# EAGLE design ttgo (EAGLE 9.6.2)

## Sheet 1 of 3
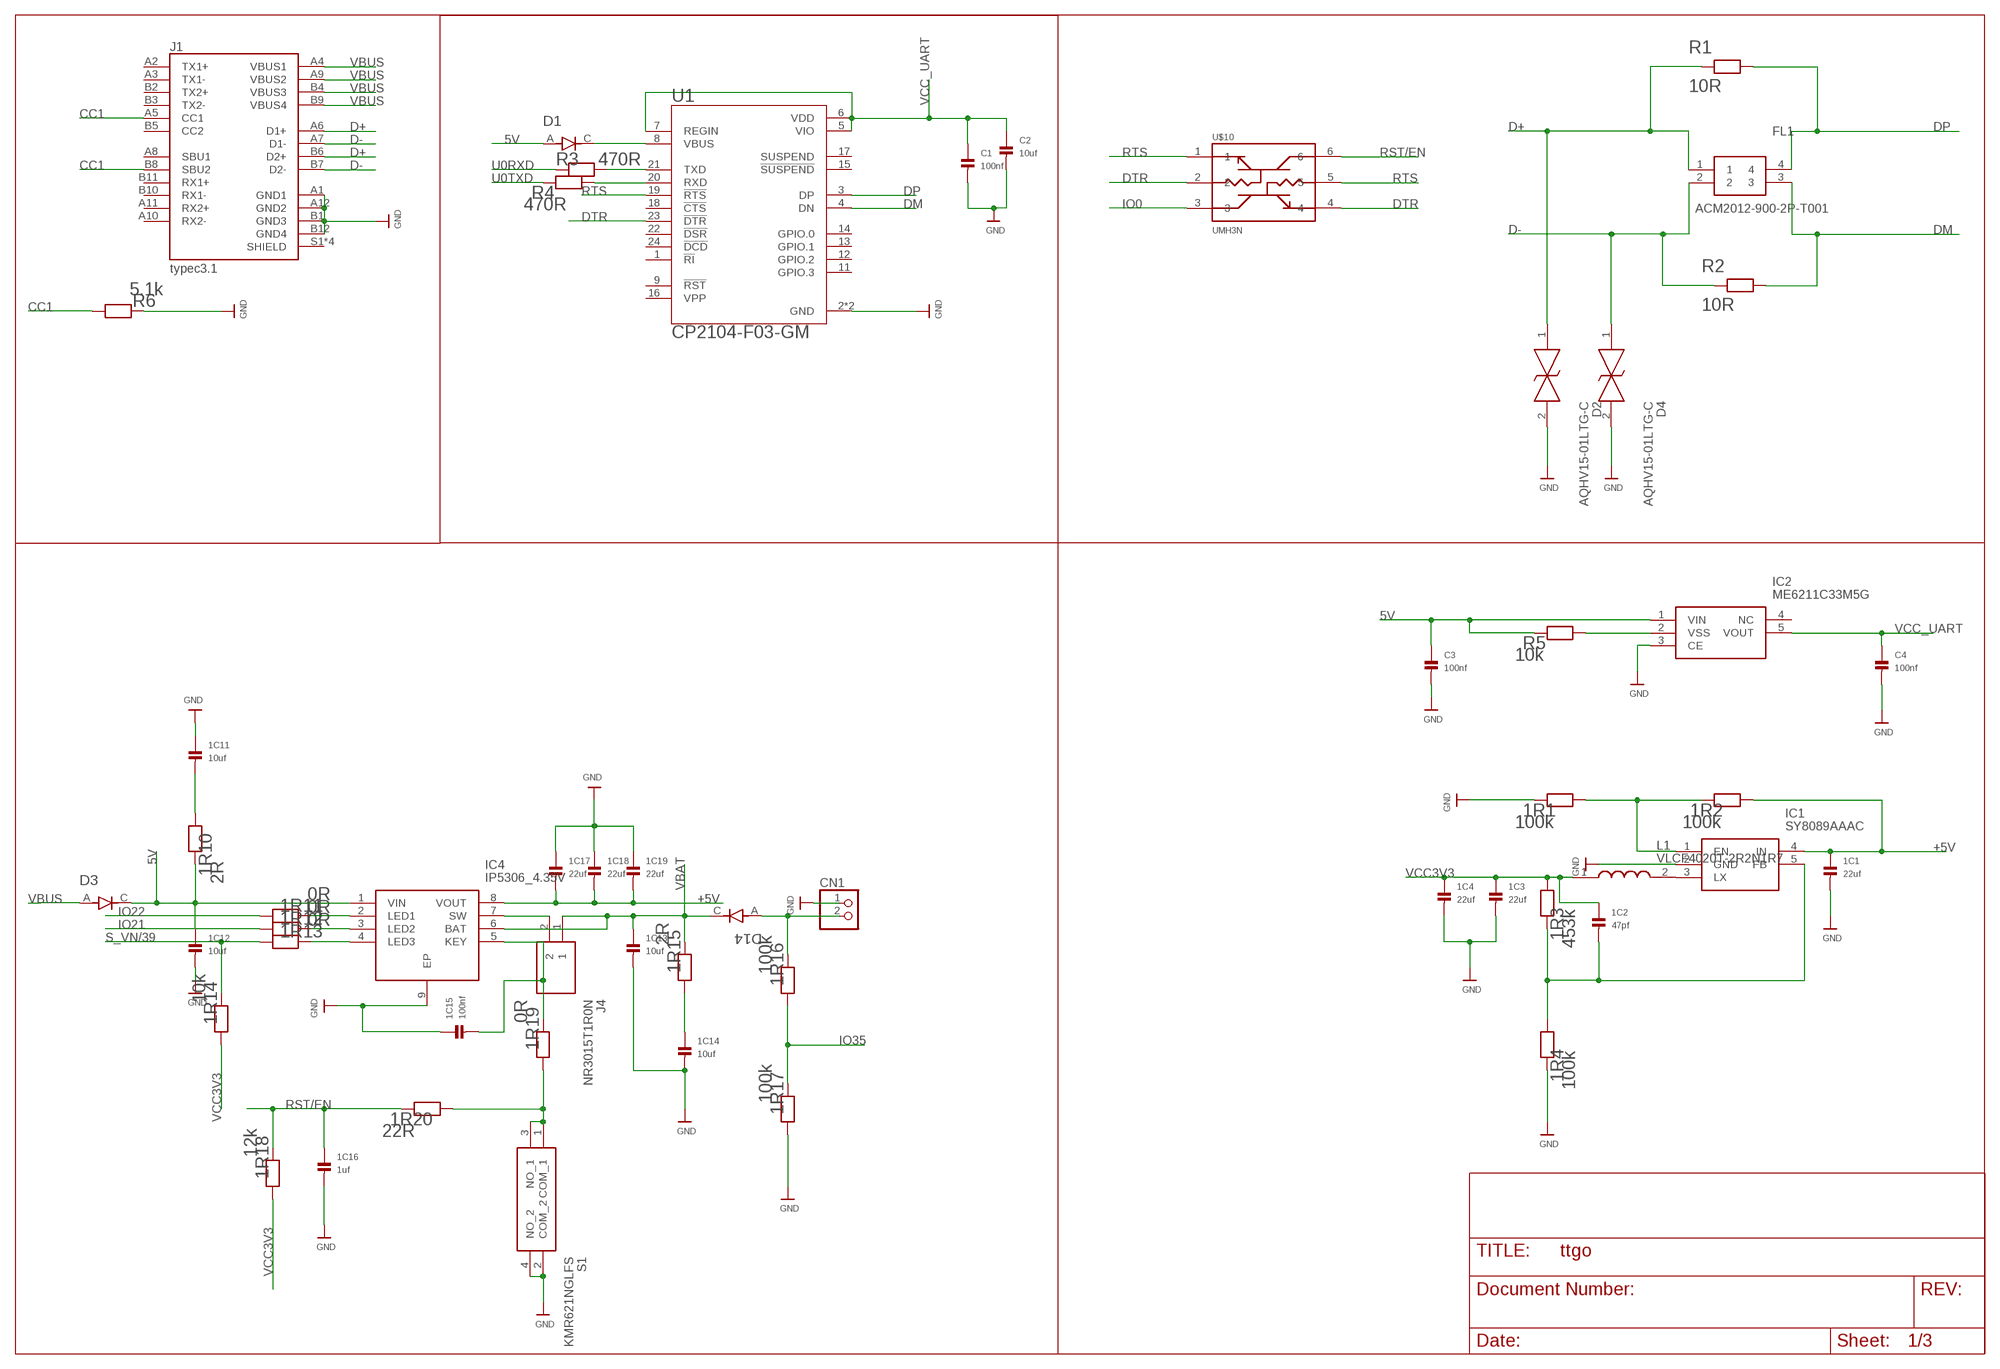
[diagram p0: schematic, sheet 1]

### Parts
1C1  22uf  CAP_CERAMIC_0402  [_0402]
1C2  47pf  CAP_CERAMIC_0402  [_0402]
1C3  22uf  CAP_CERAMIC_0402  [_0402]
1C4  22uf  CAP_CERAMIC_0402  [_0402]
1C11  10uf  CAP_CERAMIC_0402  [_0402]
1C12  10uf  CAP_CERAMIC_0402  [_0402]
1C13  10uf  CAP_CERAMIC_0402  [_0402]
1C14  10uf  CAP_CERAMIC_0402  [_0402]
1C15  100nf  CAP_CERAMIC_0402  [_0402]
1C16  1uf  CAP_CERAMIC_0402  [_0402]
1C17  22uf  CAP_CERAMIC_0402  [_0402]
1C18  22uf  CAP_CERAMIC_0402  [_0402]
1C19  22uf  CAP_CERAMIC_0402  [_0402]
1R1  100k  RESISTOR0402  [0402]
1R2  100k  RESISTOR0402  [0402]
1R3  453k  RESISTOR0402  [0402]
1R4  100k  RESISTOR0402  [0402]
1R10  2R  RESISTOR0402  [0402]
1R11  0R  RESISTOR0402  [0402]
1R12  0R  RESISTOR0402  [0402]
1R13  0R  RESISTOR0402  [0402]
1R14  10k  RESISTOR0402  [0402]
1R15  2R  RESISTOR0402  [0402]
1R16  100k  RESISTOR0402  [0402]
1R17  100k  RESISTOR0402  [0402]
1R18  12k  RESISTOR0402  [0402]
1R19  0R  RESISTOR0402  [0402]
1R20  22R  RESISTOR0402  [0402]
C1  100nf  CAP_CERAMIC_0402  [_0402]
C2  10uf  CAP_CERAMIC_0402  [_0402]
C3  100nf  CAP_CERAMIC_0402  [_0402]
C4  100nf  CAP_CERAMIC_0402  [_0402]
CN1  JST_2PINSH2  [JSTSH2]
D1  1N4148WT  [SODFL1608X70N]
D2  AQHV15-01LTG-C  [AQHV1501LTGC]
D3  1N4148WT  [SODFL1608X70N]
D4  AQHV15-01LTG-C  [AQHV1501LTGC]
D14  1N4148WT  [SODFL1608X70N]
FL1  ACM2012-900-2P-T001  [ACM20129002PT001]
IC1  SY8089AAAC  [SOT95P285X140-5N]
IC2  ME6211C33M5G  [SOT95P282X145-5N]
IC4  IP5306_4.35V  [SOIC127P600X165-9N]
J1  typec3.1  105450-0101  [MOLEX_105450-0101]
J4  NR3015T1R0N  [NR3015T1R0N]
L1  VLCF4020T-2R2N1R7  [VLCF4020_1]
R1  10R  RESISTOR0402  [0402]
R2  10R  RESISTOR0402  [0402]
R3  470R  RESISTOR0402  [0402]
R4  470R  RESISTOR0402  [0402]
R5  10k  RESISTOR0402  [0402]
R6  5.1k  RESISTOR0402  [0402]
S1  KMR621NGLFS  [KMR621NGLFS]
U1  CP2104-F03-GM  [QFN50P400X400X80-25N]
U$10  UMH3N  [SOP65P210X100-6N]

### Nets
5V [suply]: 1C12.1 1R10.1 C3.1 D1.A D3.C IC2.1(VIN) IC4.1(VIN) R5.1
+5V [suply]: 1C1.1 1C17.2 1C18.2 1C19.2 1R2.2 IC1.4(IN) IC4.8(VOUT) ; also sheet 2,3
CC1: J1.A5(CC1) J1.B8(SBU2) R6.2
D+: D2.1 FL1.1 J1.A6(D1+) J1.B6(D2+) R1.1
D-: D4.1 FL1.2 J1.A7(D1-) J1.B7(D2-) R2.1
DM: FL1.3 R2.2 U1.4(DN)
DP: FL1.4 R1.2 U1.3(DP)
DTR: U1.23(!DTR) U$10.2 U$10.4
GND [suply]: 1C1.2 1C3.2 1C4.2 1C11.1 1C12.2 1C13.2 1C14.2 1C15.1 1C16.2 1C17.1 1C18.1 1C19.1 1R1.1 1R4.1 1R17.2 C1.2 C2.2 C3.2 C4.2 CN1.1 D2.2 D4.2 IC1.2(GND) IC2.3(CE) IC4.9(EP) J1.A1(GND1) J1.A12(GND2) J1.B1(GND3) J1.B12(GND4) R6.1 S1.2(COM_2) S1.4(NO_2) U1.2(GND) U1.25(GND) ; also sheet 2,3
IO0: U$10.3 ; also sheet 3
IO21: 1R12.2 ; also sheet 3
IO22: 1R11.2 ; also sheet 3
IO35: 1R16.2 1R17.1 ; also sheet 3
N$2: D1.C U1.8(VBUS)
N$3: R3.2 U1.21(TXD)
N$4: R4.2 U1.20(RXD)
N$6: IC2.2(VSS) R5.2
N$8: 1R1.2 1R2.1 IC1.1(EN)
N$9: IC1.3(LX) L1.2
N$11: 1C2.2 1R3.1 1R4.2 IC1.5(FB)
N$17: 1C14.1 1R15.2
N$20: 1C11.2 1R10.2
N$21: 1R11.1 IC4.2(LED1)
N$24: 1C15.2 1R19.1 IC4.5(KEY)
N$25: 1R12.1 IC4.3(LED2)
N$26: 1R16.1 CN1.2 D14.A
N$27: 1R13.1 IC4.4(LED3)
N$32: IC4.7(SW) J4.2
N$36: 1R19.2 1R20.2 S1.1(COM_1) S1.3(NO_1)
RST/EN: 1C16.1 1R18.1 1R20.1 U$10.6 ; also sheet 3
RTS: U1.19(!RTS) U$10.1 U$10.5
S_VN/39: 1R13.2 1R14.1 ; also sheet 3
U0RXD: R3.1 ; also sheet 3
U0TXD: R4.1 ; also sheet 3
VBAT: 1C13.1 1R15.1 D14.C IC4.6(BAT) J4.1
VBUS [suply]: D3.A J1.A4(VBUS1) J1.A9(VBUS2) J1.B4(VBUS3) J1.B9(VBUS4)
VCC3V3 [suply]: 1C2.1 1C3.1 1C4.1 1R3.2 1R14.2 1R18.2 L1.1 ; also sheet 2,3
VCC_UART [suply]: C1.1 C2.1 C4.1 IC2.5(VOUT) U1.5(VIO) U1.6(VDD) U1.7(REGIN)
Unconnected: IC2.4(NC) J1.A2(TX1+) J1.A3(TX1-) J1.A8(SBU1) J1.A10(RX2-) J1.A11(RX2+) J1.B2(TX2+) J1.B3(TX2-) J1.B5(CC2) J1.B10(RX1-) J1.B11(RX1+) J1.S1(SHIELD) J1.S2(SHIELD) J1.S3(SHIELD) J1.S4(SHIELD) U1.1(!RI) U1.9(!RST!) U1.11(GPIO.3) U1.12(GPIO.2) U1.13(GPIO.1) U1.14(GPIO.0) U1.15(!SUSPEND!) U1.16(VPP) U1.17(SUSPEND) U1.18(!CTS) U1.22(!DSR) U1.24(!DCD)

## Sheet 2 of 3
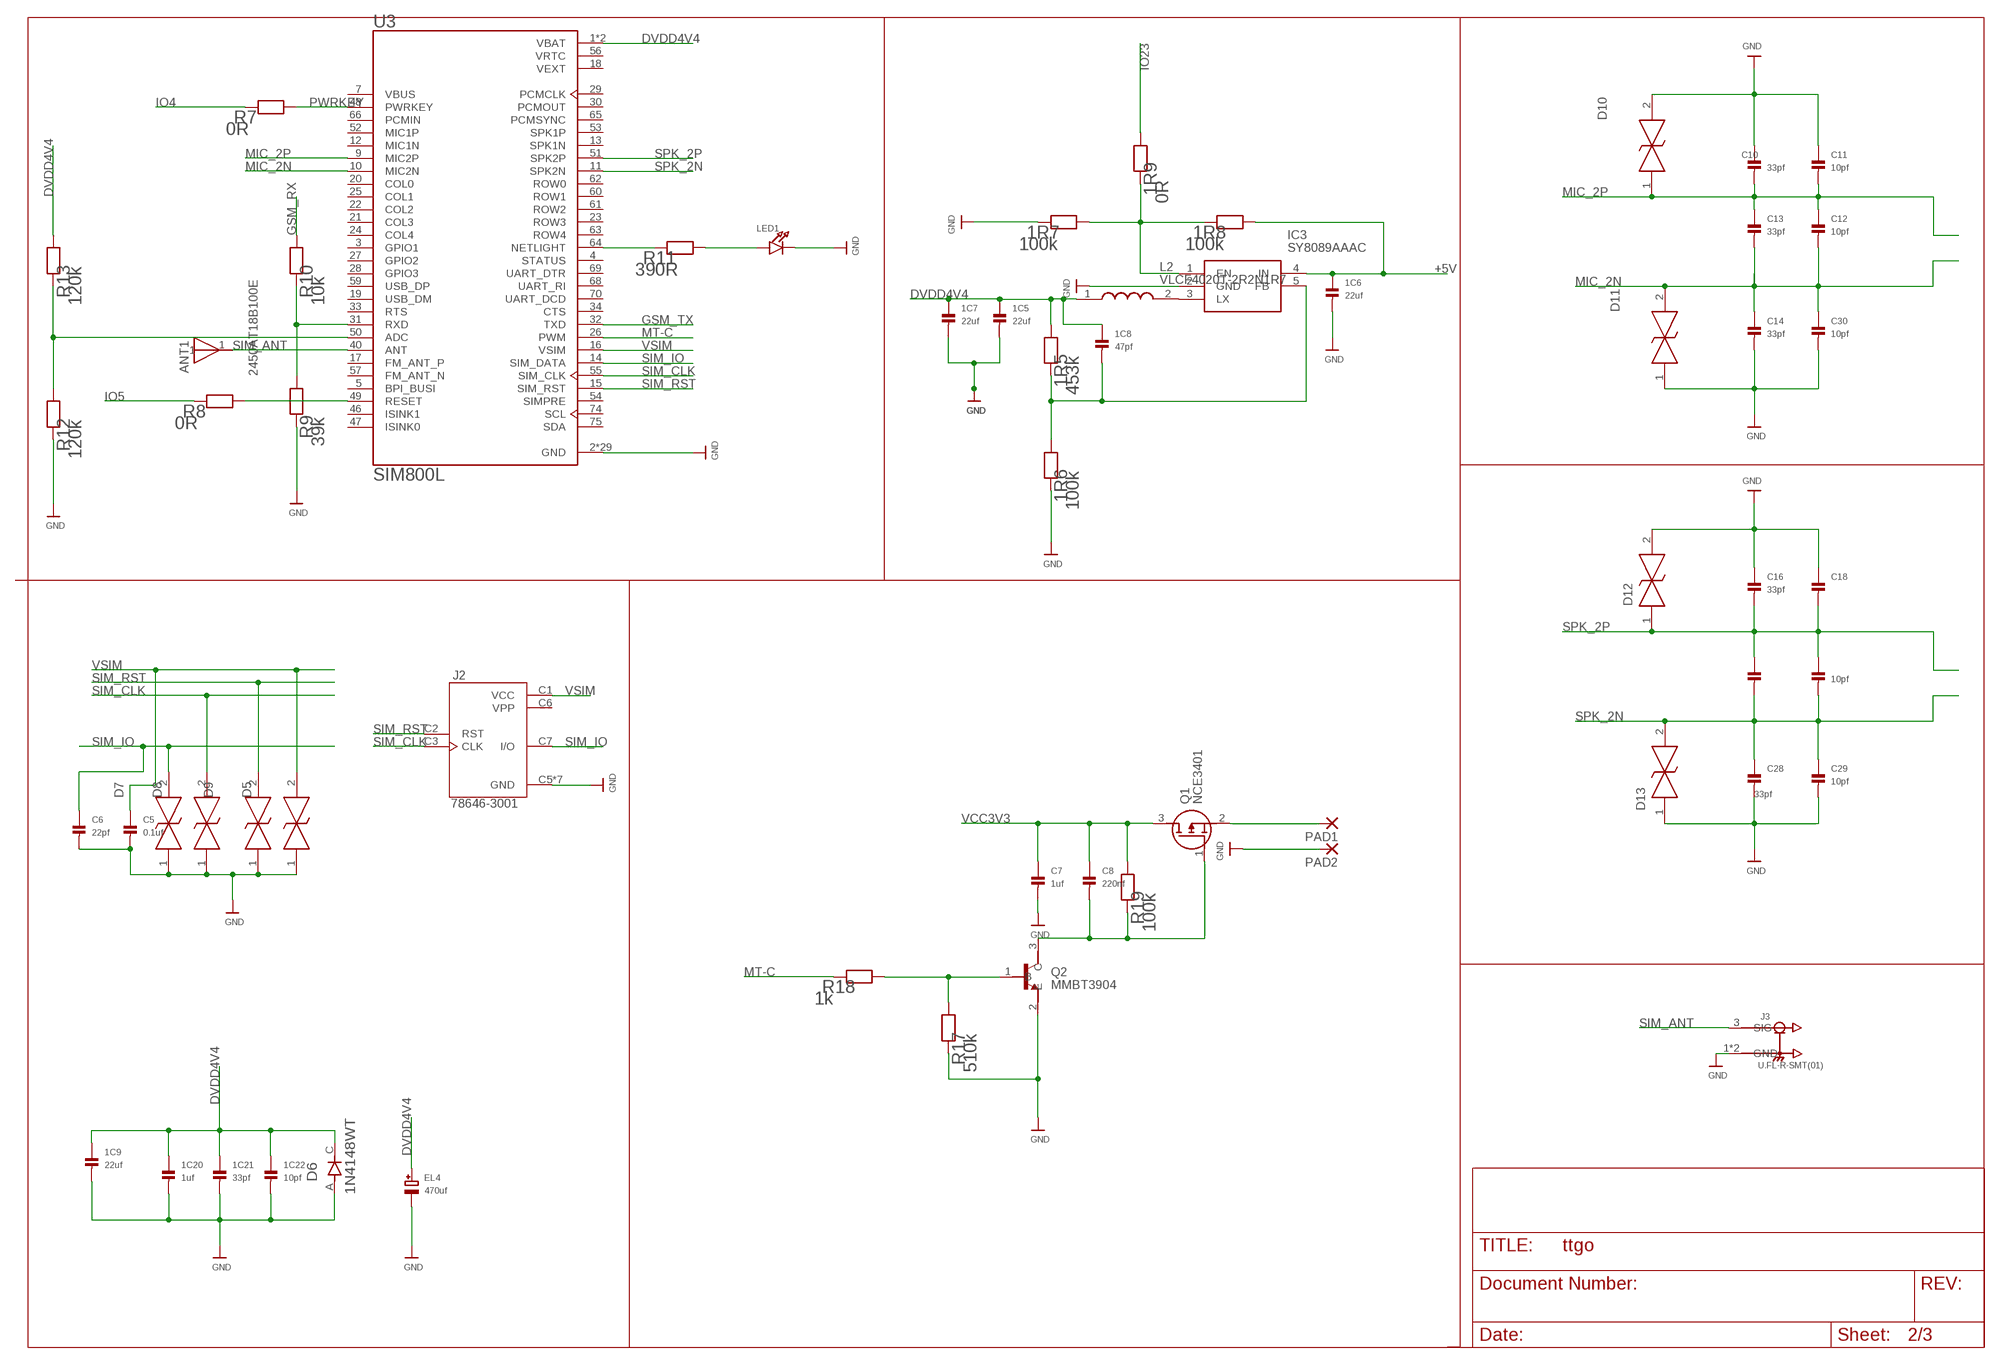
[diagram p1: schematic, sheet 2]

### Parts
1C5  22uf  CAP_CERAMIC_0402  [_0402]
1C6  22uf  CAP_CERAMIC_0402  [_0402]
1C7  22uf  CAP_CERAMIC_0402  [_0402]
1C8  47pf  CAP_CERAMIC_0402  [_0402]
1C9  22uf  CAP_CERAMIC_0402  [_0402]
1C20  1uf  CAP_CERAMIC_0402  [_0402]
1C21  33pf  CAP_CERAMIC_0402  [_0402]
1C22  10pf  CAP_CERAMIC_0402  [_0402]
1R5  453k  RESISTOR0402  [0402]
1R6  100k  RESISTOR0402  [0402]
1R7  100k  RESISTOR0402  [0402]
1R8  100k  RESISTOR0402  [0402]
1R9  0R  RESISTOR0402  [0402]
ANT1  2450AT18B100E  [ANT_2450AT18B100E]
C5  0.1uf  CAP_CERAMIC_0402  [_0402]
C6  22pf  CAP_CERAMIC_0402  [_0402]
C7  1uf  CAP_CERAMIC_0402  [_0402]
C8  220nf  CAP_CERAMIC_0402  [_0402]
C10  33pf  CAP_CERAMIC_0402  [_0402]
C11  10pf  CAP_CERAMIC_0402  [_0402]
C12  10pf  CAP_CERAMIC_0402  [_0402]
C13  33pf  CAP_CERAMIC_0402  [_0402]
C14  33pf  CAP_CERAMIC_0402  [_0402]
C16  33pf  CAP_CERAMIC_0402  [_0402]
C18  10pf  CAP_CERAMIC_0402  [_0402]
C20  10pf  CAP_CERAMIC_0402  [_0402]
C26  33pf  CAP_CERAMIC_0402  [_0402]
C28  33pf  CAP_CERAMIC_0402  [_0402]
C29  10pf  CAP_CERAMIC_0402  [_0402]
C30  10pf  CAP_CERAMIC_0402  [_0402]
D5  AQHV15-01LTG-C  [AQHV1501LTGC]
D6  1N4148WT  [SODFL1608X70N]
D7  AQHV15-01LTG-C  [AQHV1501LTGC]
D8  AQHV15-01LTG-C  [AQHV1501LTGC]
D9  AQHV15-01LTG-C  [AQHV1501LTGC]
D10  AQHV15-01LTG-C  [AQHV1501LTGC]
D11  AQHV15-01LTG-C  [AQHV1501LTGC]
D12  AQHV15-01LTG-C  [AQHV1501LTGC]
D13  AQHV15-01LTG-C  [AQHV1501LTGC]
EL4  470uf  CAP_TANTALUMC/6032_REFLOW  [EIA6032-28/C-R]
IC3  SY8089AAAC  [SOT95P285X140-5N]
J2  78646-3001  [MOLEX_78646-3001]
J3  U.FL-R-SMT(01)  [HRS_U.FL-R-SMT(01)]
L2  VLCF4020T-2R2N1R7  [VLCF4020_1]
LED1  LED0603_NOOUTLINE  [CHIPLED_0603_NOOUTLINE]
PAD1  SMD2  [SMD1,27-2,54]
PAD2  SMD2  [SMD1,27-2,54]
Q1  NCE3401  [SOT95P240X115-3N]
Q2  MMBT3904  [SOT95P240X120-3N]
R7  0R  RESISTOR0402  [0402]
R8  0R  RESISTOR0402  [0402]
R9  39k  RESISTOR0402  [0402]
R10  10k  RESISTOR0402  [0402]
R11  390R  RESISTOR0402  [0402]
R12  120k  RESISTOR0402  [0402]
R13  120k  RESISTOR0402  [0402]
R17  510k  RESISTOR0402  [0402]
R18  1k  RESISTOR0402  [0402]
R19  100k  RESISTOR0402  [0402]
U3  SIM800L  [MODULE_SIM800L]

### Nets
+5V [suply]: 1C6.1 1R8.2 IC3.4(IN) ; also sheet 1,3
DVDD4V4 [suply]: 1C5.1 1C7.1 1C8.1 1C9.1 1C20.1 1C21.1 1C22.1 1R5.2 D6.C EL4.+ L2.1 R13.2 U3.1(VBAT) U3.42(VBAT)
GND [suply]: 1C5.2 1C6.2 1C7.2 1C9.2 1C20.2 1C21.2 1C22.2 1R6.1 1R7.1 C5.2 C6.2 C7.2 C10.1 C11.1 C14.2 C16.1 C18.1 C28.2 C29.2 C30.2 D5.1 D6.A D7.1 D8.1 D9.1 D10.2 D11.1 D12.2 D13.1 EL4.- IC3.2(GND) J2.C5(GND) J2.G1(GND) J2.G2(GND) J2.G3(GND) J2.G4(GND) J2.G5(GND) J2.G6(GND) J3.1(GND) J3.2(GND) LED1.C PAD2.1(P) Q2.2(E) R9.1 R12.1 R17.1 U3.2(GND) U3.6(GND) U3.8(GND) U3.35(GND) U3.37(GND) U3.38(GND) U3.39(GND) U3.41(GND) U3.43(GND) U3.44(GND) U3.45(GND) U3.58(GND) U3.67(GND) U3.71(GND) U3.72(GND) U3.73(GND) U3.76(GND) U3.77(GND) U3.78(GND) U3.79(GND) U3.80(GND) U3.81(GND) U3.82(GND) U3.83(GND) U3.84(GND) U3.85(GND) U3.86(GND) U3.87(GND) U3.88(GND) ; also sheet 1,3
GSM_RX: R10.2 ; also sheet 3
GSM_TX: U3.32(TXD) ; also sheet 3
IO4: R7.1 ; also sheet 3
IO5: R8.1 ; also sheet 3
IO23: 1R9.2 ; also sheet 3
MIC_2N: C12.2 C13.2 C14.1 C30.1 D11.2 U3.10(MIC2N) ; also sheet 3
MIC_2P: C10.2 C11.2 C12.1 C13.1 D10.1 U3.9(MIC2P) ; also sheet 3
MT-C: R18.1 U3.26(PWM)
N$5: 1R7.2 1R8.1 1R9.1 IC3.1(EN)
N$7: R12.2 R13.1 U3.50(ADC)
N$10: IC3.3(LX) L2.2
N$12: R11.1 U3.64(NETLIGHT)
N$13: 1C8.2 1R5.1 1R6.2 IC3.5(FB)
N$15: Q2.1(B) R17.2 R18.2
N$19: PAD1.1(P) Q1.2(S)
N$22: R9.2 R10.1 U3.31(RXD)
N$23: R8.2 U3.49(RESET)
N$29: C8.2 Q1.1(G) Q2.3(C) R19.1
N$31: LED1.A R11.2
PWRKEY: R7.2 U3.48(PWRKEY)
SIM_ANT: ANT1.1 J3.3(SIG) U3.40(ANT)
SIM_CLK: D8.2 J2.C3(CLK) U3.55(SIM_CLK)
SIM_IO: C6.1 D7.2 J2.C7(I/O) U3.14(SIM_DATA)
SIM_RST: D9.2 J2.C2(RST) U3.15(SIM_RST)
SPK_2N: C20.2 C26.2 C28.1 C29.1 D13.2 U3.11(SPK2N) ; also sheet 3
SPK_2P: C16.2 C18.2 C20.1 C26.1 D12.1 U3.51(SPK2P) ; also sheet 3
VCC3V3 [suply]: C7.1 C8.1 Q1.3(D) R19.2 ; also sheet 1,3
VSIM: C5.1 D5.2 J2.C1(VCC) U3.16(VSIM)
Unconnected: U3.3(GPIO1) U3.4(STATUS) U3.5(BPI_BUSI) U3.7(VBUS) U3.12(MIC1N) U3.13(SPK1N) U3.17(FM_ANT_P) U3.19(USB_DM) U3.20(COL0) U3.21(COL3) U3.22(COL2) U3.23(ROW3) U3.24(COL4) U3.25(COL1) U3.27(GPIO2) U3.28(GPIO3) U3.29(PCMCLK) U3.30(PCMOUT) U3.33(RTS) U3.34(CTS) U3.46(ISINK1) U3.47(ISINK0) U3.52(MIC1P) U3.53(SPK1P) U3.54(SIMPRE) U3.57(FM_ANT_N) U3.59(USB_DP) U3.60(ROW1) U3.61(ROW2) U3.62(ROW0) U3.63(ROW4) U3.65(PCMSYNC) U3.66(PCMIN) U3.68(UART_RI) U3.69(UART_DTR) U3.70(UART_DCD) U3.74(SCL) U3.75(SDA)

## Sheet 3 of 3
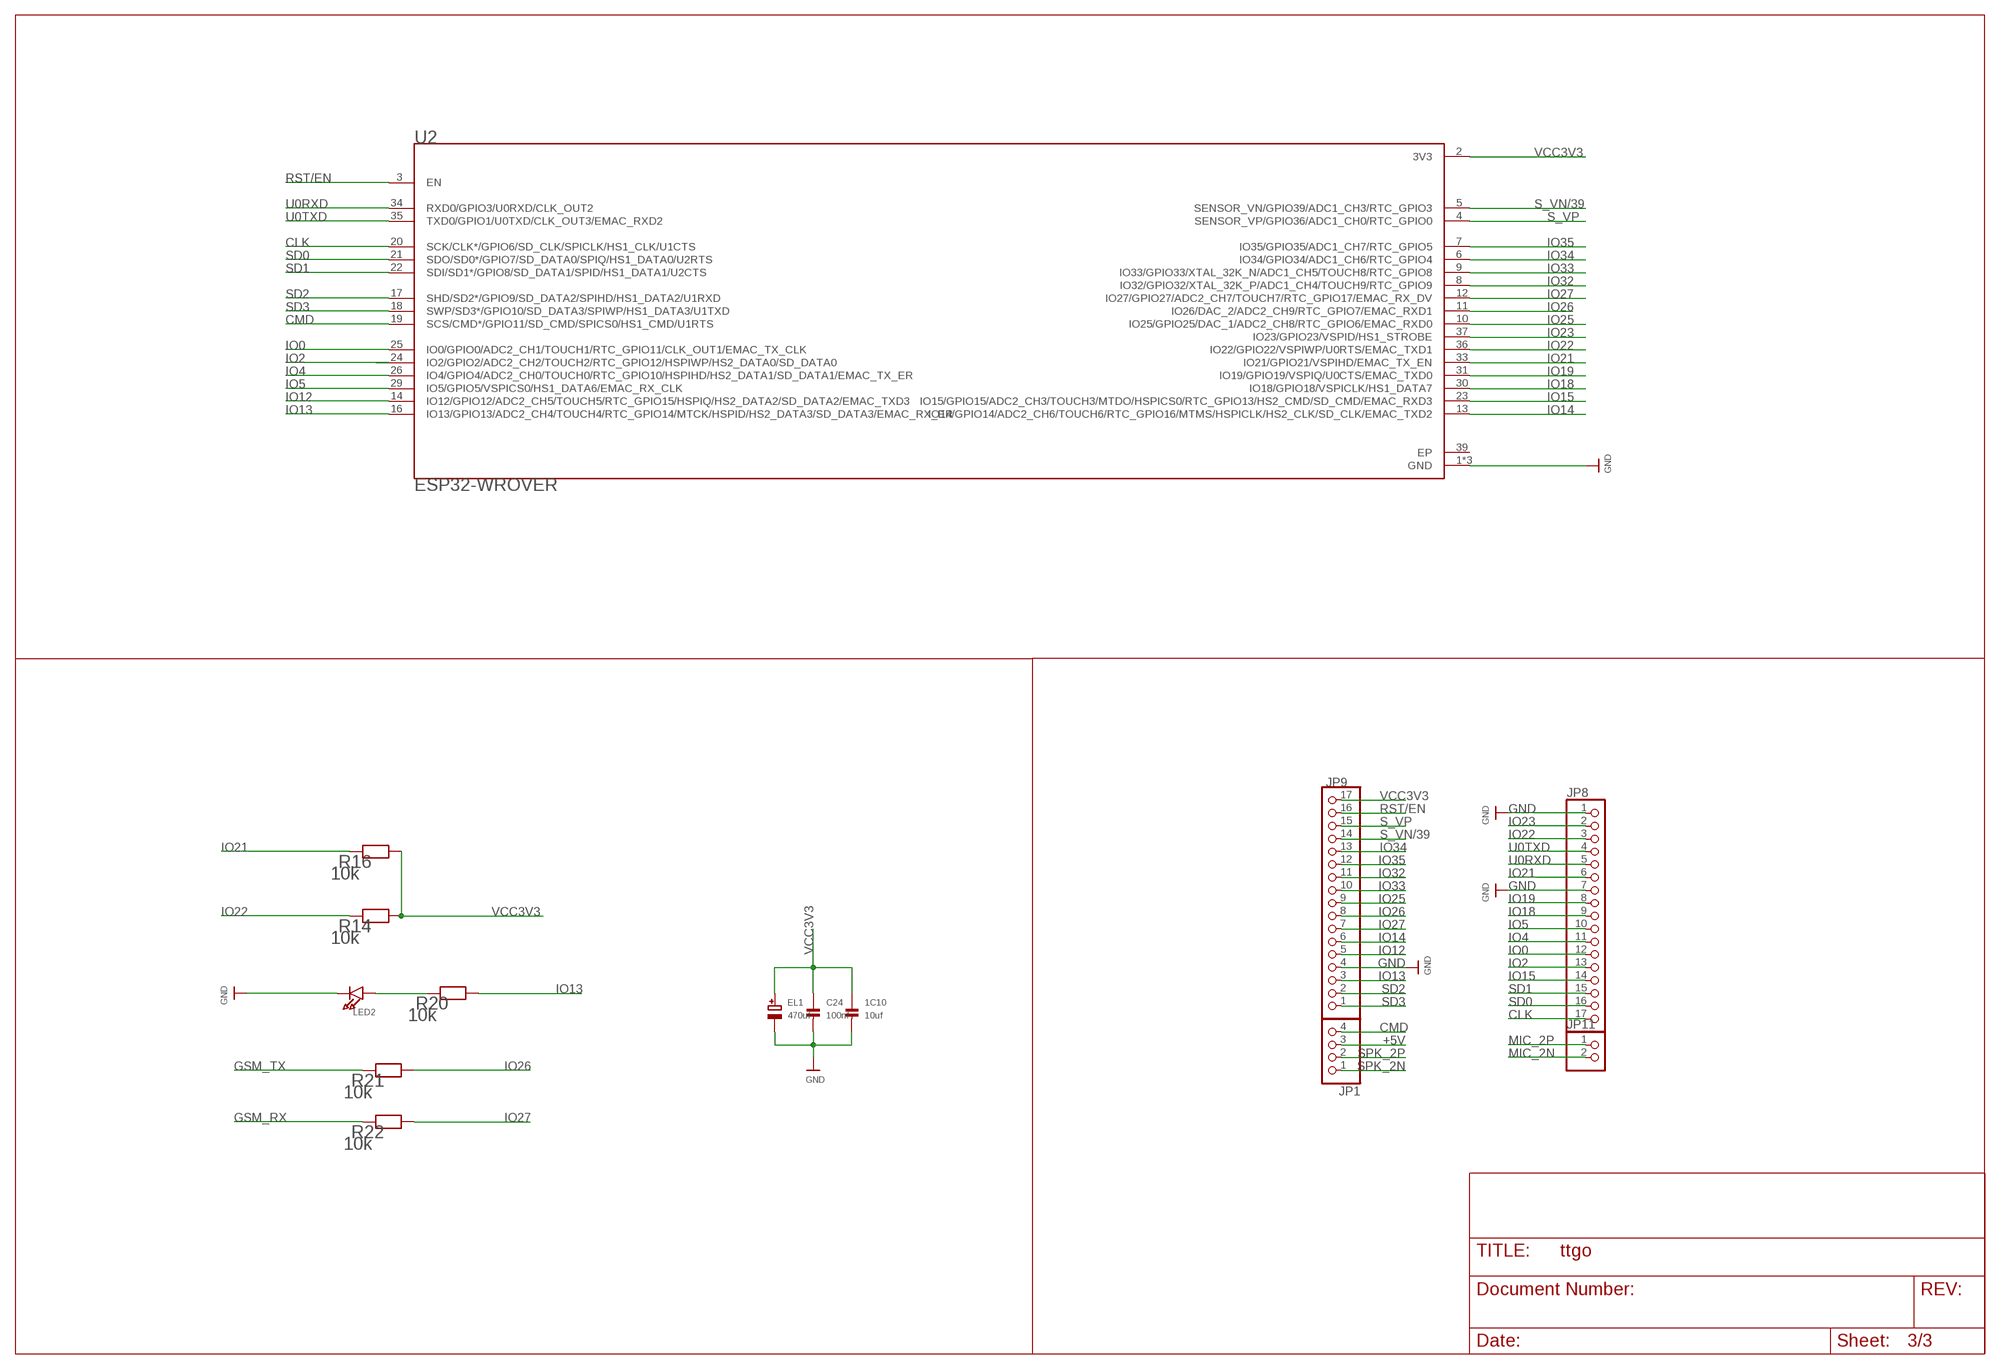
[diagram p2: schematic, sheet 3]

### Parts
1C10  10uf  CAP_CERAMIC_0402  [_0402]
C24  100nf  CAP_CERAMIC_0402  [_0402]
EL1  470uf  CAP_TANTALUMC/6032_REFLOW  [EIA6032-28/C-R]
JP1  HEADER-1X4ROUND  [1X04_ROUND]
JP8  HEADER-1X17  [1X17_ROUND70]
JP9  HEADER-1X17  [1X17_ROUND70]
JP11  HEADER-1X2ROUND  [1X02_ROUND]
LED2  LED0603_NOOUTLINE  [CHIPLED_0603_NOOUTLINE]
R14  10k  RESISTOR0402  [0402]
R16  10k  RESISTOR0402  [0402]
R20  10k  RESISTOR0402  [0402]
R21  10k  RESISTOR0402  [0402]
R22  10k  RESISTOR0402  [0402]
U2  ESP32-WROVER  [XCVR_ESP32-WROVER]

### Nets
+5V [suply]: JP1.3 ; also sheet 1,2
CLK: JP8.17 U2.20(SCK/CLK*/GPIO6/SD_CLK/SPICLK/HS1_CLK/U1CTS)
CMD: JP1.4 U2.19(SCS/CMD*/GPIO11/SD_CMD/SPICS0/HS1_CMD/U1RTS)
GND [suply]: 1C10.2 C24.2 EL1.- JP8.1 JP8.7 JP9.4 LED2.C U2.1(GND) U2.15(GND) U2.38(GND) ; also sheet 1,2
GSM_RX: R22.1 ; also sheet 2
GSM_TX: R21.1 ; also sheet 2
IO0: JP8.12 U2.25(IO0/GPIO0/ADC2_CH1/TOUCH1/RTC_GPIO11/CLK_OUT1/EMAC_TX_CLK) ; also sheet 1
IO2: JP8.13 U2.24(IO2/GPIO2/ADC2_CH2/TOUCH2/RTC_GPIO12/HSPIWP/HS2_DATA0/SD_DATA0)
IO4: JP8.11 U2.26(IO4/GPIO4/ADC2_CH0/TOUCH0/RTC_GPIO10/HSPIHD/HS2_DATA1/SD_DATA1/EMAC_TX_ER) ; also sheet 2
IO5: JP8.10 U2.29(IO5/GPIO5/VSPICS0/HS1_DATA6/EMAC_RX_CLK) ; also sheet 2
IO12: JP9.5 U2.14(IO12/GPIO12/ADC2_CH5/TOUCH5/RTC_GPIO15/HSPIQ/HS2_DATA2/SD_DATA2/EMAC_TXD3)
IO13: JP9.3 R20.2 U2.16(IO13/GPIO13/ADC2_CH4/TOUCH4/RTC_GPIO14/MTCK/HSPID/HS2_DATA3/SD_DATA3/EMAC_RX_ER)
IO14: JP9.6 U2.13(IO14/GPIO14/ADC2_CH6/TOUCH6/RTC_GPIO16/MTMS/HSPICLK/HS2_CLK/SD_CLK/EMAC_TXD2)
IO15: JP8.14 U2.23(IO15/GPIO15/ADC2_CH3/TOUCH3/MTDO/HSPICS0/RTC_GPIO13/HS2_CMD/SD_CMD/EMAC_RXD3)
IO18: JP8.9 U2.30(IO18/GPIO18/VSPICLK/HS1_DATA7)
IO19: JP8.8 U2.31(IO19/GPIO19/VSPIQ/U0CTS/EMAC_TXD0)
IO21: JP8.6 R16.1 U2.33(IO21/GPIO21/VSPIHD/EMAC_TX_EN) ; also sheet 1
IO22: JP8.3 R14.1 U2.36(IO22/GPIO22/VSPIWP/U0RTS/EMAC_TXD1) ; also sheet 1
IO23: JP8.2 U2.37(IO23/GPIO23/VSPID/HS1_STROBE) ; also sheet 2
IO25: JP9.9 U2.10(IO25/GPIO25/DAC_1/ADC2_CH8/RTC_GPIO6/EMAC_RXD0)
IO26: JP9.8 R21.2 U2.11(IO26/DAC_2/ADC2_CH9/RTC_GPIO7/EMAC_RXD1)
IO27: JP9.7 R22.2 U2.12(IO27/GPIO27/ADC2_CH7/TOUCH7/RTC_GPIO17/EMAC_RX_DV)
IO32: JP9.11 U2.8(IO32/GPIO32/XTAL_32K_P/ADC1_CH4/TOUCH9/RTC_GPIO9)
IO33: JP9.10 U2.9(IO33/GPIO33/XTAL_32K_N/ADC1_CH5/TOUCH8/RTC_GPIO8)
IO34: JP9.13 U2.6(IO34/GPIO34/ADC1_CH6/RTC_GPIO4)
IO35: JP9.12 U2.7(IO35/GPIO35/ADC1_CH7/RTC_GPIO5) ; also sheet 1
MIC_2N: JP11.2 ; also sheet 2
MIC_2P: JP11.1 ; also sheet 2
N$14: LED2.A R20.1
RST/EN: JP9.16 U2.3(EN) ; also sheet 1
S_VN/39: JP9.14 U2.5(SENSOR_VN/GPIO39/ADC1_CH3/RTC_GPIO3) ; also sheet 1
S_VP: JP9.15 U2.4(SENSOR_VP/GPIO36/ADC1_CH0/RTC_GPIO0)
SD0: JP8.16 U2.21(SDO/SD0*/GPIO7/SD_DATA0/SPIQ/HS1_DATA0/U2RTS)
SD1: JP8.15 U2.22(SDI/SD1*/GPIO8/SD_DATA1/SPID/HS1_DATA1/U2CTS)
SD2: JP9.2 U2.17(SHD/SD2*/GPIO9/SD_DATA2/SPIHD/HS1_DATA2/U1RXD)
SD3: JP9.1 U2.18(SWP/SD3*/GPIO10/SD_DATA3/SPIWP/HS1_DATA3/U1TXD)
SPK_2N: JP1.1 ; also sheet 2
SPK_2P: JP1.2 ; also sheet 2
U0RXD: JP8.5 U2.34(RXD0/GPIO3/U0RXD/CLK_OUT2) ; also sheet 1
U0TXD: JP8.4 U2.35(TXD0/GPIO1/U0TXD/CLK_OUT3/EMAC_RXD2) ; also sheet 1
VCC3V3 [suply]: 1C10.1 C24.1 EL1.+ JP9.17 R14.2 R16.2 U2.2(3V3) ; also sheet 1,2

## Power pins joined to a net without a drawn wire
EP: U2.39(EP)
VEXT: U3.18(VEXT)
VPP: J2.C6(VPP)
VRTC: U3.56(VRTC)

## Library data of the parts
1C1-1C22 C1-C8 C10-C14 C16 C18 C20 C24 C26 C28-C30 = microbuilder:CAP_CERAMIC: Ceramic Capacitors 0402 - 0402 Surface Mount Capacitors 16pF 50V 5% [Digikey: 445-4899-2-ND] 18pF 50V 5% [Digikey: 490-1281-2-ND] 22pF 50V 5% [Digikey: 490-1283-2-ND] 68pF 50V 5% [Digikey: 490-1289-2-ND] 0.1uF 10V 10% [Digikey: 490-1318-2-ND] 1.0uF 6.3V 10% [Digikey: 490-1320-2-ND] 0603 - 0603 Surface Mount Capacitors 16 pF 50V 5% [Digikey: 445-5051-2-ND] 22 pF 50V [Digikey: PCC220ACVTR-ND] 33 pF 50V 5% [Digikey: 490-1415-1-ND] 56pF 50V 5% [Digikey: 490-1421-1-ND] 220pF 50V 5% [Digikey: 445-1285-1-ND] 680 pF 50V 2200 pF 50V 5% C0G [Digikey: 445-1297-1-ND] 5600 pF 100V 5% X7R [Digikey: 478-3711-1-ND] 0.1 µF 25V 10% [Digikey: PCC2277TR-ND] 0.22 µF 16V 10% X7R [Digikey: 445-1318-1-ND] 1.0 µF 25V 10% [Digikey: 445-5146-2-ND] 0603 - RF Specific 3pF 250V +/-0.1pF RF [Digikey: 712-1347-1-ND] 18 pF 250V 5% [Digikey: 478-3505-1-ND or 712-1322-1-ND] 56 pF 250V 5% C0G RF [Digikey: 490-4867-1-ND] 68 pF 250V RF [Digikey: 490-4868-1-ND] 0805 - 0805 Surface Mount Capacitors 220 pF 250V 2% RF Ceramic Capacitor [Digikey: 712-1398-1-ND] 1000 pF 50V 2% NP0 Ceramic Capacitor [Digikey: 478-3760-1-ND] 0.1 µF 25V 10% Ceramic Capacitor [Digikey: PCC1828TR-ND] 1.0 µF 16V 10% Ceramic Capacitor[Digikey: 490-1691-2-ND] 10.0 µF 10V 10% Ceramic Capacitor[Digikey: 709-1228-1-ND] 10.0 uF 16V 10% Ceramic Capacitor [Digikey: 478-5165-2-ND] 47 uF 6.3V 20% Ceramic Capacitor [Digikey: 587-1779-1-ND or 399-5506-1-ND] 1206 - 1206 Surface Mount Capacitors 47uF 10V 20% Ceramic Capacitor [Digikey: 490-5528-1-ND or 399-5508-1-ND or 445-6010-1-ND] 100uF 6.3V -20%, +80% Y5V Ceramic Capacitor (Digikey: 490-4512-1-ND, Mouser: 81-GRM31CF50J107ZE1L)
1R1-1R20 R1-R14 R16-R22 = microbuilder:RESISTOR: Resistors 0402 - 0402 Surface Mount Package 22 Ohm 1% 1/16W [Digikey: 311-22.0LRTR-ND] 33 Ohm 5% 1/16W 1.0K 5% 1/16W 1.5K 5% 1/16W 2.0K 1% 1/16W 10.0K 1% 1/16W [Digikey: 311-10.0KLRTR-ND] 10.0K 5% 1/16W [Digikey: RMCF0402JT10K0TR-ND] 12.1K 1% 1/16W [Digikey: 311-22.0LRTR-ND] 100.0K 5% 1/16W 0603 - 0603 Surface Mount Package 0 Ohm 1/10 Watt 1% Resistor 15 Ohm 1/10 Watt 1% Resistor 33 Ohm 1/10 Watt 1% Resistor 49.9 Ohm 1/10 Watt 1% Resistor 100 Ohm 1/10 Watt 1% Resistor 150 Ohm 1/10 Watt 1% Resistor 240 Ohm 1/10 Watt 1% Resistor 390 Ohm 1/10 Watt 1% Resistor 560 Ohm 1/10 Watt 1% Resistor 680 Ohm 1/10 Watt 1% Resistor 750 Ohm 1/10 Watt 1% Resistor 1.0K Ohm 1/10 Watt 1% Resistor 1.5K Ohm 1/10 Watt 1% Resistor 2.0K Ohm 1/10 Watt 1% Resistor 2.2K Ohm 1/10 Watt 1% Resistor 3.3K Ohm 1/10 Watt 1% Resistor 4.7K Ohm 1/10 Watt 1% Resistor 10.0K Ohm 1/10 Watt 1% Resistor 12.0K Ohm 1/10 Watt 1% Resistor 12.1K Ohm 1/10 Watt 1% Resistor 20.0K Ohm 1/10 Watt 1% Resistor 33.0K Ohm 1/10 Watt 1% Resistor 100.0K Ohm 1/10 Watt 1% Resistor 0805 - 0805 Surface Mount Package 0 Ohm 1/8 Watt 1% Resistor 33 Ohm 1/8 Watt 1% Resistor 100 Ohm 1/8 Watt 1% Resistor 150 Ohm 1/8 Watt 1% Resistor 200 Ohm 1/8 Watt 1% Resistor 240 Ohm 1/8 Watt 1% Resistor 330 Ohm 1/8 Watt 1% Resistor 390 Ohm 1/8 Watt 1% Resistor 470 Ohm 1/8 Watt 1% Resistor 1.0K Ohm 1/8 Watt 1% Resistor 1.5K Ohm 1/8 Watt 1% Resistor 2.0K Ohm 1/8 Watt 1% Resistor 4.7K Ohm 1/8 Watt 1% Resistor 5.1K Ohm 1/8 Watt 1% Resistor 5.6K Ohm 1/8 Watt 1% Resistor 10.0K Ohm 1/8 Watt 1% Resistor 22.0K Ohm 1/8 Watt 1% Resistor 33.0K Ohm 1/8 Watt 1% Resistor 100K Ohm 1/8 Watt 1% Resistor 1206 - 1206 Surface Mount Package 2012 - 2010 Surface Mount Package 0.11 Ohm 1/2 Watt 1% Resistor - Digikey: RHM.11UCT-ND
ANT1 = 2450AT18B100E:2450AT18B100E: ANTENNA, CERAMIC, 2.45GHZ; Bandwidth: 100MHz; Frequency: 2.45GHz; Gain: -0.5dB; Impedance: 50ohm http://www.snapeda.com/parts/2450AT18B100E/Johanson/view-part/#; ARROW_ELECTRONICS-PURCHASE-URL: https://snapeda.com/shop?store=Arrow+Electronics&id=49105; AVAILABILITY: Unavailable; DESCRIPTION: 2.4GHz Chip RF Antenna 2.4GHz ~ 2.5GHz 0.5dBi Solder Surface Mount; DIGIKEY-PURCHASE-URL: https://snapeda.com/shop?store=DigiKey&id=49105; MF: Johanson Technology; MOUSER-PURCHASE-URL: https://snapeda.com/shop?store=Mouser&id=49105; MP: 2450AT18B100E; PACKAGE: None; PRICE: None
CN1 = microbuilder:JST_2PIN: JST 2-Pin Right-Angle Connector PH-Series - 4UConnector: 17311 SH-Series - 4UConnector: 07278
D1 D3 D6 D14 = 1N4148WT:1N4148WT: Diode Switching 100V 0.125A 2-Pin SOD-523; AVAILABILITY: Unavailable; DESCRIPTION: Diode Standard 100V 300mA (DC) Surface Mount SOD-123; MF: Micro Commercial; MP: 1N4148W+; PACKAGE: SOD-123 Multicomp; PRICE: None
D2 D4 D5 D7-D13 = AQHV15-01LTG-C:AQHV15-01LTG-C: ESD Suppressors / TVS Diodes 1Ch 300W 15V Bi-Dir Source: Datasheet <https://componentsearchengine.com/Datasheets/1/AQHV15-01LTG-C.pdf>; ARROW_PART_NUMBER: AQHV15-01LTG-C; DESCRIPTION: ESD Suppressors / TVS Diodes 1Ch 300W 15V Bi-Dir; HEIGHT: 0.77mm; MANUFACTURER_NAME: LITTELFUSE; MANUFACTURER_PART_NUMBER: AQHV15-01LTG-C; MOUSER_PART_NUMBER: 576-AQHV15-01LTG-C; MOUSER_PRICE-STOCK: https://www.mouser.co.uk/ProductDetail/Littelfuse/AQHV15-01LTG-C?qs=qSfuJ%252Bfl%2Fd7ApUs5jOR9YA%3D%3D
EL1 EL4 = microbuilder:CAP_TANTALUM: Tantalum Capacitors Wave footprints have larger pads and are meant to be used for hand soldering. Reflow footprints are optimised for solder paste and a reflow oven. EIA3216-18/A-[R/W] - Size A / 3216-18 / 1206 footprint 4.7µF 25V 10% Tantalum Capacitor 10µF 16V 10% Tantalum Capacitor [Digikey: 495-2236-2-ND] EIA3528-21/B-[R/W] - Size B / 3528-21 47µF 10V 10% Tantalum Capactior [Digikey: 495-2216-1-ND] EIA6032-28/C-[R/W] - Size C / 6032-28 10µF 35V 20% Tantalum Capacitor [Digikey: 495-2285-1-ND] 100µF 16V 10% Tantalum Capactior [Digikey: 399-5214-1-ND]
FL1 = ACM2012-900-2P-T001:ACM2012-900-2P-T001: Common Mode Chokes Dual 90Ohm 100MHz 400mA 190mOhm DCR SMD Automotive T/R Source: Datasheet <https://www.mouser.com/datasheet/2/400/mf_automotive_signal_acm2012_en-837177.pdf>; ARROW_PART_NUMBER: ACM2012-900-2P-T001; ARROW_PRICE-STOCK: https://www.arrow.com/en/products/acm2012-900-2p-t001/tdk; DESCRIPTION: Common Mode Chokes Dual 90Ohm 100MHz 400mA 190mOhm DCR SMD Automotive T/R; HEIGHT: 1.3mm; MANUFACTURER_NAME: TDK; MANUFACTURER_PART_NUMBER: ACM2012-900-2P-T001; MOUSER_PART_NUMBER: 810-ACM20129002PT001; MOUSER_PRICE-STOCK: https://www.mouser.com/Search/Refine.aspx?Keyword=810-ACM20129002PT001
IC1 IC3 = SY8089AAAC:SY8089AAAC: DC-DC Converters Step-Down Adjustable 1 2.7V 5.5V 0.6V 5.5V 2A SOT-23-5 RoHS Source: Datasheet <https://datasheet.lcsc.com/szlcsc/Silergy-Corp-SY8089AAAC_C78988.pdf>; ARROW_PART_NUMBER: SY8089AAAC; DESCRIPTION: DC-DC Converters Step-Down Adjustable 1 2.7V 5.5V 0.6V 5.5V 2A SOT-23-5 RoHS; HEIGHT: 1.4mm; MANUFACTURER_NAME: Silergy Corp; MANUFACTURER_PART_NUMBER: SY8089AAAC
IC2 = ME6211C33M5G:ME6211C33M5G: High Speed LDO Regulators, High PSRR, Low noise, ME6211 Series Source: Datasheet <http://xinhuidianzi.com.cn/UploadSysFiles/files/LDO-series/ME6211-Series_E15.0.pdf>; ARROW_PART_NUMBER: ME6211C33M5G; DESCRIPTION: High Speed LDO Regulators, High PSRR, Low noise, ME6211 Series; HEIGHT: 1.45mm; MANUFACTURER_NAME: Microne; MANUFACTURER_PART_NUMBER: ME6211C33M5G
IC4 = IP5306_4.35V:IP5306_4.35V: 2.1A Charging 2.4 A Discharge Highly Integrated Mobile Power Supply Source: Datasheet <https://datasheet.lcsc.com/szlcsc/1906271838_INJOINIC-IP5306-4-35V_C384572.pdf>; ARROW_PART_NUMBER: IP5306_4.35V; DESCRIPTION: 2.1A Charging 2.4 A Discharge Highly Integrated Mobile Power Supply; HEIGHT: 1.65mm; MANUFACTURER_NAME: INJOINIC; MANUFACTURER_PART_NUMBER: IP5306_4.35V
J1 = 105450-0101:105450-0101: USB Shielded I/O Receptacle; Type C; Right Angle; Surface Mount; Gold over Nickel; AVAILABILITY: Unavailable; DESCRIPTION: USB-C (USB TYPE-C) USB 3.1 (USB 3.1 Gen 2, Superspeed+) Receptacle Connector 24 Position Surface Mount, Right Angle; Through Hole; MF: Molex; MP: 1054500101; PACKAGE: None; PRICE: None
J2 = 78646-3001:78646-3001: Conn Micro SIM Card SKT 6 POS 2.54mm Solder RA SMD 0.5A/Contact Embossed T/R; AVAILABILITY: Unavailable; DESCRIPTION: 6 Position Card Connector Micro SIM Surface Mount, Right Angle Gold; MF: Molex; MP: 78646-3001; PACKAGE: None; PRICE: None
J3 = U.FL-R-SMT_01_:U.FL-R-SMT(01): U.FL Series 6 Ghz 50 Ohm Ultra-small SMT Coaxial Cable Receptacle Buy Part <https://snapeda.com/parts/U.FL-R-SMT%2801%29/Hirose/view-part/?ref=eda>; AVAILABILITY: Warning; DESCRIPTION: U.FL (UMCC) Connector Receptacle, Male Pin 50Ohm Surface Mount Solder; DIGIKEY-PURCHASE-URL: https://snapeda.com/shop?store=DigiKey&id=49572; MF: Hirose; MOUSER-PURCHASE-URL: https://snapeda.com/shop?store=Mouser&id=49572; MP: U.FL-R-SMT(01); PACKAGE: None; PRICE: None
J4 = NR3015T1R0N:NR3015T1R0N: TAIYO YUDEN - NR3015T1R0N - INDUCTOR, SHIELDED, 1UH, 2.1A, SMD Source: Datasheet <https://www.yuden.co.jp/productdata/catalog/wound04_e.pdf>; ARROW_PART_NUMBER: NR3015T1R0N; DESCRIPTION: TAIYO YUDEN - NR3015T1R0N - INDUCTOR, SHIELDED, 1UH, 2.1A, SMD; HEIGHT: 1.5mm; MANUFACTURER_NAME: TAIYO YUDEN; MANUFACTURER_PART_NUMBER: NR3015T1R0N; MOUSER_PART_NUMBER: 963-NR3015T1R0N; MOUSER_PRICE-STOCK: https://www.mouser.co.uk/ProductDetail/Taiyo-Yuden/NR3015T1R0N?qs=PzICbMaShUfhiP3egv9Geg%3D%3D
JP1 = microbuilder:HEADER-1X4: PIN HEADER
JP8 JP9 = microbuilder:HEADER-1X17: Header 1x17
JP11 = microbuilder:HEADER-1X2: PIN HEADER
L1 L2 = VLCF4020T-2R2N1R7:VLCF4020T-2R2N1R7: TDK VLCF Series Shielded Wire-wound SMD Inductor 2.2 uH +/-30% Wire-Wound 2.19A Idc Source: Datasheet <https://docs-emea.rs-online.com/webdocs/14e9/0900766b814e91dd.pdf>; ARROW_PART_NUMBER: VLCF4020T-2R2N1R7; ARROW_PRICE-STOCK: https://www.arrow.com/en/products/vlcf4020t-2r2n1r7/tdk; DESCRIPTION: TDK VLCF Series Shielded Wire-wound SMD Inductor 2.2 uH +/-30% Wire-Wound 2.19A Idc; HEIGHT: mm; MANUFACTURER_NAME: TDK; MANUFACTURER_PART_NUMBER: VLCF4020T-2R2N1R7; MOUSER_PART_NUMBER: 810-VLCF4020T2R2N1R7; MOUSER_PRICE-STOCK: https://www.mouser.co.uk/ProductDetail/TDK/VLCF4020T-2R2N1R7?qs=O2qRfqcg9D%252B6mk3XbPg%2FgA%3D%3D
LED1 LED2 = microbuilder:LED: LED 0603 - 0603 Surface Mount Package 2mA: Green LED - Low Power (3.9mcd, 2ma, 1.7Vf) - Digikey: 475-2709-2-ND Orange LED - Low Power (9.8mcd, 2ma, 1.8Vf) - Digikey: 475-1194-2-ND Red LED - Low Power (5mcd, 2ma, 1.8Vf) - Digikey: 475-1195-2-ND Yellow LED - Low Power (7mcd, 2ma, 1.8Vf) - Digikey: 475-1196-2-ND 5mA: Blue LED - Low Power (17mcd, 5ma, 2.9Vf) - Digikey: LNJ937W8CRACT-ND 0805 - 0805 Surface Mount Package 2mA: Red LED (8.8mcd, 2mA, 1.8Vf, Clear) - Low Power [Digikey: 475-2510-1-ND] Green LED (5mcd, 2mA, 1.8Vf, Clear) - Low Power [Digikey: 475-2730-1-ND] Yellow LED (11.3mcd, 2mA, 1.8Vf, Clear) - Low Power [Digikey: 475-2555-1-ND] 20mA: Red LED (104mcd, 20mA, Diffused) - LS R976 [Digikey: 475-1278-6-ND] Red LED (12mcd, 20mA, 2.0Vf, Clear) - APT2012EC [Digikey: 754-1128-1-ND] Green LED (15mcd, 20mA, 2.2Vf, Clear) - APT2012GC [Digikey: 754-1131-1-ND] Orange LED (160mcd, 20mA, 2.1Vf, Clear) - APT2012SECK [Digikey: 754-1130-1-ND] 1206 - 1206 Surface Mount Package Green LED (26mcd, 20mA, Diffused) - LG N971 [Digikey: 475-1407-6-ND] Red LED (15mcd, 20mA, Diffused) - LH N974 [Digikey: 475-1416-6-ND]
PAD1 PAD2 = wirepad:SMD2: SMD PAD
Q1 = NCE3401:NCE3401: MOSFET P Trench 30V 4.2A 1.3V @ 250uA 55 m @ 4.2A,10V SOT-23(SOT-23-3) RoHS Source: Datasheet <https://datasheet.lcsc.com/szlcsc/Wuxi-NCE-Power-Semiconductor-NCE3401_C113490.pdf>; ARROW_PART_NUMBER: NCE3401; DESCRIPTION: MOSFET P Trench 30V 4.2A 1.3V @ 250uA 55 m @ 4.2A,10V SOT-23(SOT-23-3) RoHS; HEIGHT: 1.15mm; MANUFACTURER_NAME: Wuxi NCE Power Semiconductor; MANUFACTURER_PART_NUMBER: NCE3401
Q2 = MMBT3904:MMBT3904: MMBT3904 Series 40 V CE Breakdown 0.2 A NPN General Purpose Amplifier - SOT-23; ARROW_ELECTRONICS-PURCHASE-URL: https://snapeda.com/shop?store=Arrow+Electronics&id=2875870; AVAILABILITY: Unavailable; DESCRIPTION: Bipolar (BJT) Transistor NPN 40V 200mA 300MHz 300mW Surface Mount SOT-23-3; MF: STMicroelectronics; MP: MMBT3904; PACKAGE: SOT-23-3 Taiwan Semiconductor; PRICE: None
S1 = KMR621NGLFS:KMR621NGLFS: Tactile Switches 50mA 32VDC 1.9mmH 2N IP67 Source: Datasheet <https:////www.ckswitches.com/media/1907/kmr6.pdf>; ARROW_PART_NUMBER: KMR621NGLFS; DESCRIPTION: Tactile Switches 50mA 32VDC 1.9mmH 2N IP67; HEIGHT: 1.9mm; MANUFACTURER_NAME: C & K COMPONENTS; MANUFACTURER_PART_NUMBER: KMR621NGLFS; MOUSER_PART_NUMBER: 611-KMR621NGLFS; MOUSER_PRICE-STOCK: https://www.mouser.co.uk/ProductDetail/CK/KMR621NGLFS?qs=HXFqYaX1Q2yW62rsqjQaoA%3D%3D
U1 = CP2104:CP2104: Silabs CP2104 USB to UART Bridge; AVAILABILITY: Unavailable; DESCRIPTION: USB Bridge, USB to UART USB 2.0 UART Interface 24-QFN (4x4); MF: Silicon Labs; MP: CP2104; PACKAGE: QFN-24 Silicon Labs; PRICE: None
U2 = ESP32-WROVER:ESP32-WROVER: Module: combo; GPIO, I2C x2, I2S x2, SDIO, SPI x3, UART x3; 19.5dBm; AVAILABILITY: Unavailable; DESCRIPTION: Bluetooth, WiFi 802.11b/g/n, Bluetooth v4.2 +EDR, Class 1, 2 and 3 Transceiver Module 2.4GHz ~ 2.5GHz PCB Trace Surface Mount; DIGIKEY-PURCHASE-URL: https://snapeda.com/shop?store=DigiKey&id=2293722; MF: Espressif Systems; MOUSER-PURCHASE-URL: https://snapeda.com/shop?store=Mouser&id=2293722; MP: ESP32-WROVER; PACKAGE: Module Espressif Systems; PRICE: None
U3 = SIM800L:SIM800L: SIM8000L. Quad-band GSM/GPRS Module; AVAILABILITY: Unavailable; DESCRIPTION: SIM800L GSM RF M5Stack Platform Evaluation Expansion Board; MF: Simcom; MP: SIM800L; PACKAGE: None; PRICE: None
U$10 = UMH3N:UMH3N: Dual PNP/NPN transistor for chip reset; AVAILABILITY: Unavailable; DESCRIPTION: Pre-Biased Bipolar Transistor (BJT) 2 NPN - Pre-Biased (Dual) 50V 100mA 250MHz 150mW Surface Mount UMT6; MF: Rohm; MP: UMH3N; PACKAGE: SOT-363 Rohm; PRICE: None

## Net classes
0 default: width 0.152 mm, clearance 0.152 mm
1 suply: width 0.203 mm

## Board
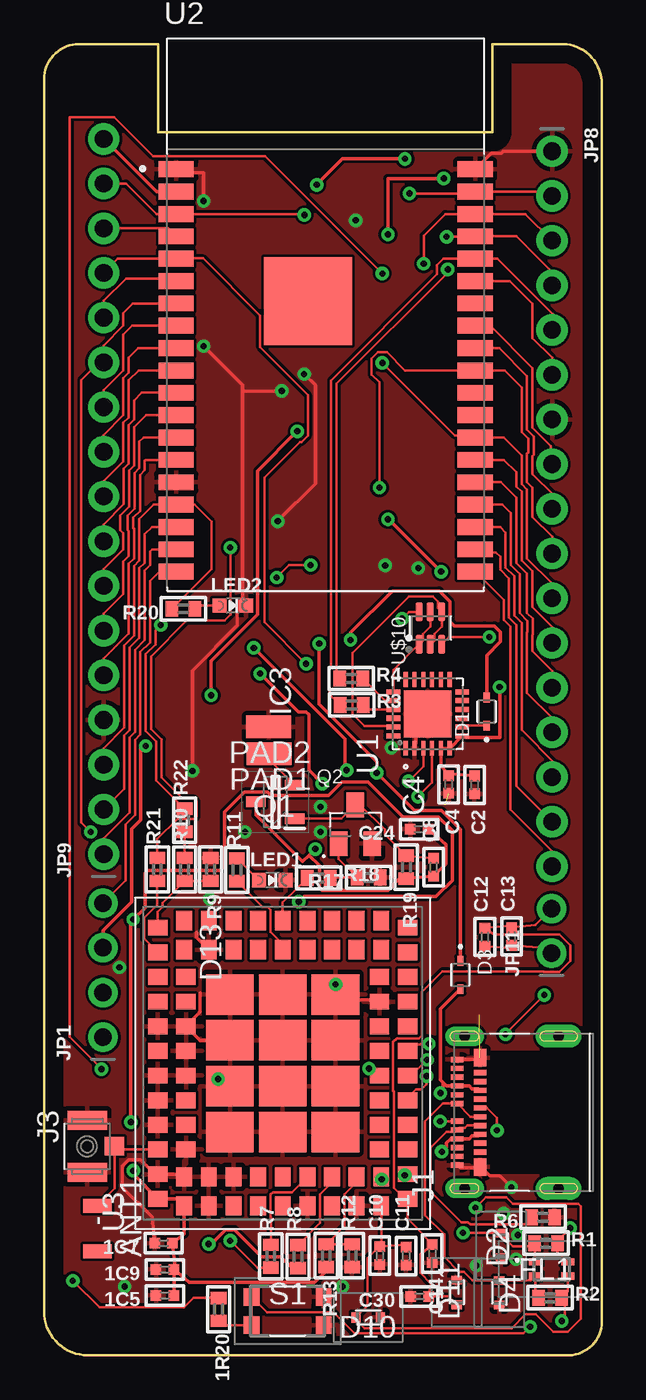
[diagram p3: board, top side]
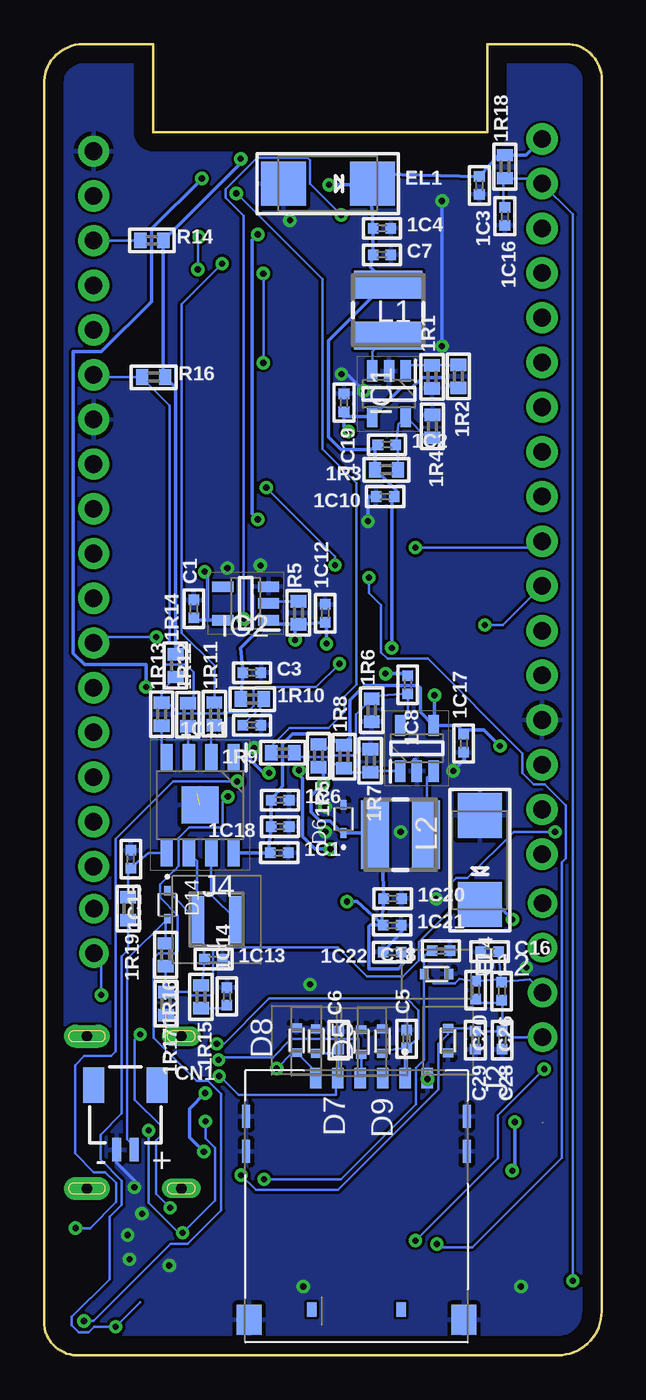
[diagram p4: board, bottom side, seen from below]

Size 31.7 x 74.51 mm. Coordinates in mm from the lower left corner, seen from the top.
Outline: 2.5,74.51 6.5,74.51 6.5,69.51 25.5,69.51 25.5,74.51 29.5,74.51 arc-90 31.7,72.21 31.7,1.71 arc-90 29.5,0.01 2.5,0.01 arc-90 0,2.51 0,72.51 arc-90 2,74.51 2.5,74.51
Outline: 2.5,74.51 2.32,74.51
Copper layers (1*16): Top 0.035mm / dielectric 1.5mm / Bottom 0.035mm
Design rules "default": minimum track width 6mil, minimum drill 0.35mm, track to track 6mil, track to pad 6mil, pad to pad 6mil, via to via 6mil, smd to smd 6mil, copper to edge 40mil, drill to drill 6mil, minimum pad ring 10mil, minimum via ring 8mil, stop-mask expansion 4mil, vias tented up to drill 0mil, thermal gap 10mil

### Footprints (pad centres in the part's own frame; a part is rotated, then mirrored left to right if it is on the bottom)
_0402 = smd 0.6 x 0.6: 1 -0.508,0; 2 0.508,0
0402 = smd 0.7 x 0.9: 1 -0.65,0; 2 0.65,0
ANT_2450AT18B100E = smd 0.8 x 1.6: 1 -1.3,0; 2 1.3,0
JSTSH2 = smd 0.5 x 1.35: 1 -0.5,-2.55; 2 0.5,-2.55 | smd 1.2 x 2: NC1 -1.8,1.125; NC2 1.8,1.125
SODFL1608X70N = smd 0.53 x 0.4: A 0.8,0; C -0.8,0
AQHV1501LTGC = smd 0.5 x 0.6: 1 -0.7,0; 2 0.7,0
EIA6032-28/C-R = smd 2.55 x 2.5: + 2.525,0; - -2.525,0
ACM20129002PT001 = smd 0.75 x 0.4: 1 -0.925,0.4; 2 -0.925,-0.4; 3 0.925,-0.4; 4 0.925,0.4
SOT95P285X140-5N = smd 1.2 x 0.6: 1 -1.3,0.95; 2 -1.3,0; 3 -1.3,-0.95; 4 1.3,-0.95; 5 1.3,0.95
SOT95P282X145-5N = smd 1.2 x 0.6: 1 -1.3,0.95; 2 -1.3,0; 3 -1.3,-0.95; 4 1.3,-0.95; 5 1.3,0.95
SOIC127P600X165-9N = smd 1.525 x 0.7: 1 -2.712,1.905; 2 -2.712,0.635; 3 -2.712,-0.635; 4 -2.712,-1.905; 5 2.712,-1.905; 6 2.712,-0.635; 7 2.712,0.635; 8 2.712,1.905 | smd 2.09 x 2.09: 9 0,0
MOLEX_105450-0101 = smd 0.3 x 0.7: A1 -3,3.77; A2 -2.5,3.77; A3 -2,3.77; A4 -1.5,3.77; A5 -1,3.77; A6 -0.5,3.77; A7 0.5,3.77; A8 1,3.77; A9 1.5,3.77; A10 2,3.77; A11 2.5,3.77; A12 3,3.77; B2 2.25,2.47; B3 1.75,2.47; B4 1.25,2.47; B5 0.75,2.47; B6 0.25,2.47; B7 -0.25,2.47; B8 -0.75,2.47; B9 -1.25,2.47; B10 -1.75,2.47; B11 -2.25,2.47 | smd 1 x 0.7: B1 3.1,2.47; B12 -3.1,2.47 | drill 0.6 pad 1.1 long: S1 -4.32,3.36; S2 4.32,3.36 | drill 0.6 pad 1.3 long: S3 -4.32,-2; S4 4.32,-2
MOLEX_78646-3001 = smd 1.15 x 0.65: C1 -7.295,2.755; C2 -7.295,0.215; C3 -7.295,-2.325; C5 -7.295,4.025; C6 -7.295,1.485; C7 -7.295,-1.055 | smd 1.3 x 0.45: G1 -5.125,6.27; G2 -3.125,6.27; G3 -5.125,-6.27; G4 -3.125,-6.27 | smd 1.7 x 1.4: G5 6.435,-6.105; G6 6.435,6.105 | smd 0.8 x 0.54: X1 5.855,2.54; X2 5.855,-2.54
HRS_U.FL-R-SMT(01) = smd 1.1 x 2.25: 1 -1.475,0; 2 1.475,0 | smd 1.05 x 1.1: 3 0,-1.55
NR3015T1R0N = smd 0.8 x 2.7: 1 -1.1,0; 2 1.1,0
1X04_ROUND = drill 1 pad 1.676: 1 -3.81,0; 2 -1.27,0; 3 1.27,0; 4 3.81,0
1X17_ROUND70 = drill 1 pad 1.778: 1 -20.32,0; 2 -17.78,0; 3 -15.24,0; 4 -12.7,0; 5 -10.16,0; 6 -7.62,0; 7 -5.08,0; 8 -2.54,0; 9 0,0; 10 2.54,0; 11 5.08,0; 12 7.62,0; 13 10.16,0; 14 12.7,0; 15 15.24,0; 16 17.78,0; 17 20.32,0
1X02_ROUND = drill 1 pad 1.676: 1 -1.27,0; 2 1.27,0
VLCF4020_1 = smd 3.9 x 1.6: 1 0,-1.45; 2 0,1.45
CHIPLED_0603_NOOUTLINE = smd 0.8 x 0.8: A 0,-0.75; C 0,0.75
SMD1,27-2,54 = smd 1.27 x 2.54: 1 0,0
SOT95P240X115-3N = smd 1.1 x 0.6: 1 -1.1,0.95; 2 -1.1,-0.95; 3 1.1,0
SOT95P240X120-3N = smd 1 x 1.4: 1 -0.95,-1.1; 2 0.95,-1.1; 3 0,1.1
KMR621NGLFS = smd 0.9 x 1: 1 -2.05,0.8; 2 2.05,0.8; 3 -2.05,-0.8; 4 2.05,-0.8
QFN50P400X400X80-25N = smd 0.81 x 0.26: 1 -1.955,1.25; 2 -1.955,0.75; 3 -1.955,0.25; 4 -1.955,-0.25; 5 -1.955,-0.75; 6 -1.955,-1.25; 13 1.955,-1.25; 14 1.955,-0.75; 15 1.955,-0.25; 16 1.955,0.25; 17 1.955,0.75; 18 1.955,1.25 | smd 0.26 x 0.81: 7 -1.25,-1.955; 8 -0.75,-1.955; 9 -0.25,-1.955; 10 0.25,-1.955; 11 0.75,-1.955; 12 1.25,-1.955; 19 1.25,1.955; 20 0.75,1.955; 21 0.25,1.955; 22 -0.25,1.955; 23 -0.75,1.955; 24 -1.25,1.955 | smd 2.68 x 2.68: 25 0,0
XCVR_ESP32-WROVER = smd 2 x 0.9: 1 -8.5,8.26; 2 -8.5,6.99; 3 -8.5,5.72; 4 -8.5,4.45; 5 -8.5,3.18; 6 -8.5,1.91; 7 -8.5,0.64; 8 -8.5,-0.63; 9 -8.5,-1.9; 10 -8.5,-3.17; 11 -8.5,-4.44; 12 -8.5,-5.71; 13 -8.5,-6.98; 14 -8.5,-8.25; 15 -8.5,-9.52; 16 -8.5,-10.79; 17 -8.5,-12.06; 18 -8.5,-13.33; 19 -8.5,-14.6; 20 8.5,-14.6; 21 8.5,-13.33; 22 8.5,-12.06; 23 8.5,-10.79; 24 8.5,-9.52; 25 8.5,-8.25; 26 8.5,-6.98; 27 8.5,-5.71; 28 8.5,-4.44; 29 8.5,-3.17; 30 8.5,-1.9; 31 8.5,-0.63; 32 8.5,0.64; 33 8.5,1.91; 34 8.5,3.18; 35 8.5,4.45; 36 8.5,5.72; 37 8.5,6.99; 38 8.5,8.26 | smd 5 x 5: 39 -1,0.76
MODULE_SIM800L = smd 1.1 x 0.9: 1 -8.1,5.6; 2 -8.1,4.2; 3 -8.1,2.8; 4 -8.1,1.4; 5 -8.1,0; 6 -8.1,-1.4; 7 -8.1,-2.8; 8 -8.1,-4.2; 9 -8.1,-5.6; 22 8.1,-5.6; 23 8.1,-4.2; 24 8.1,-2.8; 25 8.1,-1.4; 26 8.1,0; 27 8.1,1.4; 28 8.1,2.8; 29 8.1,4.2; 30 8.1,5.6; 43 -6.45,5.6; 44 -6.45,4.2; 45 -6.45,2.8; 46 -6.45,1.4; 47 -6.45,0; 48 -6.45,-1.4; 49 -6.45,-2.8; 50 -6.45,-4.2; 51 -6.45,-5.6; 60 6.45,-5.6; 61 6.45,-4.2; 62 6.45,-2.8; 63 6.45,-1.4; 64 6.45,0; 65 6.45,1.4; 66 6.45,2.8; 67 6.45,4.2; 68 6.45,5.6 | smd 0.9 x 1.1: 10 -7.7,-7.1; 11 -6.3,-7.1; 12 -4.9,-7.1; 13 -3.5,-7.1; 14 -2.1,-7.1; 15 -0.7,-7.1; 16 0.7,-7.1; 17 2.1,-7.1; 18 3.5,-7.1; 19 4.9,-7.1; 20 6.3,-7.1; 21 7.7,-7.1; 31 7.7,7.1; 32 6.3,7.1; 33 4.9,7.1; 34 3.5,7.1; 35 2.1,7.1; 36 0.7,7.1; 37 -0.7,7.1; 38 -2.1,7.1; 39 -3.5,7.1; 40 -4.9,7.1; 41 -6.3,7.1; 42 -7.7,7.1; 52 -4.9,-5.5; 53 -3.5,-5.5; 54 -2.1,-5.5; 55 -0.7,-5.5; 56 0.7,-5.5; 57 2.1,-5.5; 58 3.5,-5.5; 59 4.9,-5.5; 69 4.9,5.5; 70 3.5,5.5; 71 2.1,5.5; 72 0.7,5.5; 73 -0.7,5.5; 74 -2.1,5.5; 75 -3.5,5.5; 76 -4.9,5.5 | smd 2.3 x 2.7: 77 -3.9,3; 78 -3.9,0; 79 -3.9,-3; 80 -1.3,-3; 81 1.3,-3; 82 3.9,-3; 83 3.9,0; 84 3.9,3; 85 1.3,3; 86 -1.3,3; 87 -1.3,0; 88 1.3,0
SOP65P210X100-6N = smd 1.09 x 0.4: 1 -0.92,0.65; 2 -0.92,0; 3 -0.92,-0.65; 4 0.92,-0.65; 5 0.92,0; 6 0.92,0.65

### Placement (x,y rotation side)
1C1  18.33,28.56 0 bottom
1C2  12.21,51.75 0 bottom
1C3  6.95,66.48 270 bottom
1C4  12.49,64.04 0 bottom
1C5  6.88,3.41 180 top
1C6  18.28,31.55 0 bottom
1C7  6.8,6.38 180 top
1C8  11.02,38.11 270 bottom
1C9  6.88,4.88 180 top
1C10  12.31,48.8 180 bottom
1C11  19.88,35.82 180 bottom
1C12  15.71,42.17 90 bottom
1C13  22.06,22.51 0 bottom
1C14  21.3,20.4 90 bottom
1C15  26.76,28.2 270 bottom
1C16  5.5,64.73 270 bottom
1C17  7.84,34.78 90 bottom
1C18  18.28,30.05 180 bottom
1C19  14.65,54.13 270 bottom
1C20  11.88,25.97 0 bottom
1C21  11.9,24.44 0 bottom
1C22  11.9,22.92 180 bottom
1R1  9.64,55.61 90 bottom
1R2  8.15,55.63 270 bottom
1R3  12.23,50.32 180 bottom
1R4  9.62,52.79 270 bottom
1R5  16.1,34.07 270 bottom
1R6  13.07,36.66 90 bottom
1R7  13.15,33.79 270 bottom
1R8  14.65,34.02 90 bottom
1R9  18.13,34.25 180 bottom
1R10  19.85,37.29 0 bottom
1R11  22.01,36.46 90 bottom
1R12  23.51,36.4 90 bottom
1R13  25.01,36.43 90 bottom
1R14  24.22,39.2 90 bottom
1R15  22.78,20.38 270 bottom
1R16  24.78,22.77 270 bottom
1R17  24.76,20 270 bottom
1R18  5.5,67.55 90 bottom
1R19  26.92,25.38 270 bottom
1R20  9.92,2.62 270 top
ANT1  3.04,7.21 270 top
C1  23.18,42.42 90 bottom
C2  24.48,32.42 270 top
C3  19.88,38.79 0 bottom
C4  23,32.44 270 top
C5  11.09,17.99 90 bottom
C6  14.95,17.91 90 bottom
C7  12.49,62.54 0 bottom
C8  22.14,27.74 90 top
C10  19.09,5.68 90 top
C11  20.59,5.65 90 top
C12  25.06,23.78 90 top
C13  26.59,23.81 90 top
C14  22.07,5.79 270 top
C16  6.37,22.94 0 bottom
C18  9.14,22.99 180 bottom
C20  7.15,20.76 270 bottom
C24  21.33,29.9 180 top
C26  5.68,20.71 270 bottom
C28  5.66,17.91 270 bottom
C29  7.18,17.91 270 bottom
C30  21.35,3.36 180 top
CN1  27.07,14.24 0 bottom
D1  25.16,36.58 90 top
D2  25.98,6.26 270 top
D3  23.66,21.62 270 top
D4  25.87,3.56 270 top
D5  12.46,17.86 270 bottom
D6  14.67,30.49 90 bottom
D7  16.22,17.86 270 bottom
D8  17.34,17.91 270 bottom
D9  13.66,17.81 270 bottom
D10  18.43,2.17 0 top
D11  23.46,3.59 270 top
D12  9.39,21.67 0 bottom
D13  8.73,17.89 90 bottom
D14  24.68,25.61 270 bottom
EL1  15.56,66.58 0 bottom
EL4  6.93,28.15 270 bottom
FL1  28.85,4.92 0 top
IC1  12.08,54.64 270 bottom
IC2  20.24,42.73 180 bottom
IC3  10.51,34.5 90 bottom
IC4  22.83,31.27 270 bottom
J1  27.26,13.81 90 top
J2  13.94,8.46 270 bottom
J3  2.46,11.88 90 top
J4  21.89,24.77 0 bottom
JP1  3.36,21.89 90 top
JP8  28.88,48.1 270 top
JP9  3.39,48.8 90 top
JP11  28.86,24.12 90 top
L1  12.13,59.39 180 bottom
L2  11.43,29.58 270 bottom
LED1  12.97,27.01 270 top
LED2  10.74,42.6 270 top
PAD1  12.79,34.2 90 top
PAD2  12.77,35.72 90 top
Q1  13.15,31.45 180 top
Q2  17.7,30.18 0 top
R1  28.54,6.38 0 top
R2  28.77,3.28 0 top
R3  17.49,36.96 0 top
R4  17.47,38.46 0 top
R5  17.24,42.2 90 bottom
R6  28.36,7.86 180 top
R7  12.89,5.64 90 top
R8  14.44,5.62 90 top
R9  9.47,27.62 270 top
R10  7.99,27.62 90 top
R11  10.96,27.59 90 top
R12  17.52,5.67 90 top
R13  16.04,5.67 270 top
R14  25.57,63.35 0 bottom
R16  25.47,55.58 0 bottom
R17  18.46,27.16 180 top
R18  15.61,27.13 0 top
R19  20.59,27.74 270 top
R20  7.92,42.42 180 top
R21  6.44,27.62 90 top
R22  7.99,30.41 90 top
S1  13.85,2.52 0 top
U1  21.81,36.46 90 top
U2  16.01,59.13 0 top
U3  13.57,16.6 90 top
U$10  21.96,41.33 90 top

### Tracks (layer width: path | path; a pad name or v marks a point on that pad's centre or on a via)
5V  (via drill 0.35)
  Top 0.203: v15.64,40.44 15.64,37 18.91,33.73 v18.91,33.1 21.06,30.96 22.58,30.96 23.66,29.88 D3.C | v17.42,40.66 17.42,41.07 19.79,43.44 22.47,43.44 23.07,42.84 23.07,41.7 23.34,41.43 25.03,41.43 25.06,41.46 25.61,41.46 25.95,41.11 25.95,40.56 25.16,39.78 D1.A
  Bottom 0.203: R5.1 18.7,41.55 IC2.1 20.53,40.18 C3.1 20.53,37.32 1R10.1 | R5.1 17.21,41.52 1C12.1 15.64,41.45 v15.64,40.44 | IC4.1 20.1,33.99 19.22,33.1 v18.91,33.1 | v17.42,40.66 17.42,41.36 R5.1
+5V  (via drill 0.35)
  Top 0.203: JP1.3 3.36,24.16 4.97,25.77 4.97,29.9 5.5,30.44 5.5,34.63 v5.78,34.63 | v9.5,37.51 9.5,39.46 12.14,42.1 12.14,50.26 v14.4,52.51
  Bottom 0.203: 1R2.2 8.51,54.98 9.09,55.56 10.2,55.56 10.78,54.98 11.39,54.98 IC1.4 14.51,53.34 1C19.2 14.65,52.77 v14.4,52.51 | IC4.8 1C1.1 18.93,28.61 1C18.2 1C6.1 18.13,32.35 18.13,34.75 17.56,35.32 15.54,35.32 14.89,34.67 | 14.99,34.67 14.89,34.67 | 14.89,34.67 14.75,34.67 | 14.75,34.67 1R8.2 | IC3.4 8.21,35.8 7.95,35.54 | 7.95,35.54 1C17.2 | v5.78,34.63 6.69,35.54 7.95,35.54 | 14.75,34.67 14.3,35.12 14.3,37.24 13.48,38.06 10.46,38.06 10.31,37.91 10.31,36.55 IC3.4 | v9.5,37.51 9.5,35.86 IC3.4
CC1
  Top 0.152: 27.56,7.7 R6.2 27.31,7.45 24.22,7.45 24.1,7.58 23.72,7.58 21.96,9.33 21.96,11.79 22.87,12.69 23.37,12.69 J1.A5 23.61,12.94 23.93,12.94 24.06,13.06 J1.B8
CLK
  Top 0.152: U2.20 26.13,42.92 26.13,41.79 26.51,41.41 26.51,31.02 28.88,28.65 JP8.17
CMD
  Top 0.152: JP1.4 4.64,26.98 4.64,30.18 5.17,30.72 5.17,34.98 5.48,35.29 5.48,39.97 6.03,40.52 6.03,44 6.57,44.53 U2.19
D+  (via drill 0.35)
  Top 0.152: FL1.1 27.89,5.35 R1.1 27.71,6.2 26.65,6.2 25.98,6.88 D2.1 25.96,6.97 v23.82,6.97 | J1.A6 22.54,13.31 v22.52,13.3 | J1.B6 25.18,14.06 25.75,13.49 v25.75,12.78
  Bottom 0.152: v22.52,13.3 22.52,12.35 21.98,11.8 21.98,8.81 v23.82,6.97 24.05,6.97 25.75,8.67 v25.75,12.78
D-
  Top 0.152: R2.1 27.92,3.48 FL1.2 27.67,4.26 D4.1 24.36,4.26 23.86,4.77 23.58,4.77 22.75,5.6 22.75,6.88 21.66,7.97 21.66,13.3 22.68,14.31 J1.A7 24.24,13.56 J1.B7
DM  (via drill 0.35)
  Top 0.152: FL1.3 29.77,3.63 R2.2 29.61,3.09 29.61,2.14 v29.43,1.96 | v21.25,31.76 22.06,32.57 U1.4
  Bottom 0.152: v21.25,31.76 21.55,31.45 21.55,30.13 21.69,30 23.46,30 24.04,29.42 24.04,27.82 24.29,27.57 24.3,27.57 25.11,26.76 25.11,26.01 24.1,25.01 24.1,22.97 24.24,22.84 25.18,22.84 25.46,22.56 25.46,18.03 23.02,15.59 22.36,15.59 21.62,14.85 21.62,8.25 23.54,6.33 24.5,6.33 28.87,1.96 v29.43,1.96
DP  (via drill 0.35)
  Top 0.152: FL1.4 29.19,5.9 R1.2 29.19,6.52 v29.91,7.24 | v20.72,32.62 21.56,33.46 U1.3
  Bottom 0.152: v29.91,7.24 29.08,7.24 27.6,8.72 27.6,9.81 28.21,10.42 28.87,10.42 29.94,11.49 29.94,16.49 29.41,17.02 27.88,17.02 27.63,17.28 27.63,29.34 24.35,32.62 v20.72,32.62
DTR
  Top 0.152: U$10.2 22.18,40.63 22.18,40.99 22.61,41.42 U$10.4 22.39,42.47 22.39,42.83 22.11,43.11 20.74,43.11 17.54,39.91 17.54,36.44 18.21,35.77 19.79,35.77 U1.23
DVDD4V4  (via drill 0.35)
  Top 0.203: 1C9.1 7.45,4.96 1C7.1 7.97,6.9 U3.1 7.57,8.9 U3.42 5.08,10.29 v5.08,10.5 | 1C9.1 1C5.1 | 1C9.1 8.26,4.15 15.38,4.15 16.05,4.81 R13.2 | v15.82,32.49 15.05,33.26 15.05,36.41 14.9,36.56 14.47,36.56 v12.29,38.74 | v4.94,13.27 4.94,24.64 v5.07,24.77 5.74,25.44 5.74,27.42 5.89,27.57 10.02,27.57 10.26,27.81 10.26,30.87 11.39,32.01 12.7,32.01 12.89,31.82 16.17,31.82 16.94,32.59 18.43,32.59 20.41,30.61 22.43,30.61 23.2,29.84 23.2,26.99 22.28,26.07 14.77,26.07 v14.48,25.79
  Bottom 0.203: 1C21.1 12.53,24.47 1C20.1 12.53,29.23 L2.1 12.98,29.69 D6.C 14.76,29.69 15.45,30.38 16.02,30.38 16.53,30.89 16.53,31.78 v15.82,32.49 15.82,33.14 1R5.2 | 1C21.1 12.58,24.47 13.14,24.47 13.24,24.37 13.24,21.98 11.56,21.98 11.26,22.28 1C22.1 | v12.29,38.74 11.03,38.74 1C8.1 | v4.94,13.27 4.94,10.64 v5.08,10.5 | v5.07,24.77 5.92,25.62 EL4.+ | 1C21.1 13.9,25.79 v14.48,25.79
GND  (via drill 0.35)  (3 unrouted)
  Top 0.203: U2.38 25.44,68.32 25.99,68.32 26.1,68.42 JP8.1 | U1.25 21.77,36.39 21.77,35.44 21.45,35.44 21.14,35.12 21.14,34.8 U1.2 | J1.A1 23.68,10.67 24.63,10.67 J1.B12 24.84,10.71 25.34,10.21 25.91,10.21 v26.56,9.56 | 16.64,20.2 18.91,20.2 U3.58 | U3.81 16.69,18.93 16.64,18.93 | U3.43 7.82,10.3 U3.41 6.33,10.3 5.5,11.13 4.82,11.13 4.45,10.76 4.45,9.56 6.15,7.87 1C7.2 | J1.B1 24.69,16.81 J1.A12 | U3.85 8.87,17.9 U3.71 8.87,19.51 8.87,20.61 | U3.85 10.34,17.34 10.49,17.34 | U3.85 10.66,17.98 10.64,17.83 | v9.07,65.6 9.07,67.19 7.8,67.19 U2.1 | v9.07,57.35 11.29,55.12 11.29,54.81 | 11.29,54.81 11.29,43.06 10.98,42.74 10.98,41.47 8.44,38.93 v8.44,33.22 | v13.52,54.81 11.29,54.81 | v14.79,55.76 15.42,55.12 15.42,49.54 v13.29,47.4 | U3.85 10.66,17.66 10.49,17.66 | U3.85 10.66,17.02 10.49,17.02 | 10.49,16.07 10.34,16.07 U3.86 | 16.64,20.43 16.69,20.52 U3.82 | U3.67 8.67,23.75 8.67,24.05
  Bottom 0.203: C1.2 23.36,42.74 23.26,42.74 | v26.56,9.56 26.56,9.93 27.57,10.94 CN1.1 | 20.18,13.85 J2.G3 | C16.1 6.85,22.74 6.94,22.74 | v9.07,57.35 v9.07,65.6 | v8.44,33.22 7.8,33.85 1C17.1 7.8,34.17 7.77,34.2 | v13.52,54.81 14.47,55.76 v14.79,55.76 | v13.29,47.4 13.29,48.77 13.2,48.77 1C10.2 | 1C21.2 11.26,24.22 1C22.2 | 13.52,35.44 13.52,35.33 | 10.66,33.85 10.58,33.85
  other vias: 4.59,3.92 17.72,64.5 19.4,44.89 21.28,44.74 24.58,5.11 9.9,15.7 26.13,8.06 26.94,6.84 26.84,5.47 16.58,21.09 15.71,29.75 19.75,34.53 15.71,31.17 11.42,29.75 16.96,3.92 9.42,25.94 4.28,22.05
  pour Top: 14.5,0.01 29.5,0.01 arc90 31.5,2.01 31.5,72.51 arc90 29.5,74.51 25.5,74.51 25.5,69.51 6.5,69.51 6.5,74.51 2,74.51 arc90 0,72.51 0,2.51 arc90 2.5,0.01
  pour Bottom: 14.5,0.01 29.5,0.01 arc90 31.5,2.01 31.5,72.51 arc90 29.5,74.51 25.5,74.51 25.5,69.51 6.5,69.51 6.5,74.51 2,74.51 arc90 0,72.51 0,2.51 arc90 2.5,0.01
GSM_RX
  Top 0.152: R10.2 R22.1
GSM_TX
  Top 0.152: R21.1 6.44,25.6 5.69,24.85 5.69,23.68 U3.32
IO0  (via drill 0.35)
  Top 0.152: U2.25 26.15,50.88 26.85,50.19 26.85,49.38 27.15,49.07 27.15,45.16 27.75,44.56 27.75,42.53 28.95,41.33 28.95,40.55 JP8.12 | U$10.3 23.02,40.82 v25.32,40.82
  Bottom 0.152: v25.32,40.82 28.54,40.82 JP8.12
IO2
  Top 0.152: U2.24 25.97,49.61 26.85,48.74 26.85,45.03 27.45,44.43 27.45,42.2 27.78,41.87 27.78,40.96 27.76,40.95 27.76,40.02 28.88,38.9 JP8.13
IO4  (via drill 0.35)
  Top 0.152: 12.61,4.71 R7.1 12.13,4.99 10.6,6.52 v10.58,6.52 | JP8.11 28.88,43.86 27.46,45.29 27.46,49.2 27.15,49.5 27.15,51.14 26.14,52.15 U2.26 24.31,52.27 23.36,52.27 v19.23,56.39 | v3.27,16.28 1.45,18.09 1.45,70.36 3.99,70.36 6.21,68.14 12.56,68.14 v19.23,61.47
  Bottom 0.152: v10.58,6.52 5.9,11.21 5.9,13.65 v3.27,16.28 | v19.23,56.39 v19.23,61.47
IO5  (via drill 0.35)
  Top 0.152: JP8.10 28.88,46.52 27.76,47.64 27.76,49.33 27.46,49.63 27.46,51.23 27.53,51.3 27.53,52.1 27.15,52.47 27.15,55 26.19,55.96 U2.29 20.52,55.96 19.48,57 18.98,57 18.63,56.65 18.63,55.74 19.07,55.3 v19.07,49.31 | v13.22,44.2 13.94,44.91 v15.16,44.91
  Top 0.203: R8.1 14.09,4.97 13.45,5.62 12.38,5.62 10.85,7.15 10.32,7.15 9.5,6.33 v9.37,6.33
  Bottom 0.152: v9.37,6.33 9.19,6.15 7.35,6.15 2.28,11.23 2.28,28.02 2.05,28.25 2.05,31.26 3.23,32.45 3.85,32.45 4.51,33.1 4.51,34.21 9.89,39.6 12.18,39.6 12.54,39.95 12.54,42.62 13.22,43.31 v13.22,44.2 | v15.16,44.91 15.16,45.4 v19.07,49.31
IO12
  Top 0.152: U2.14 5.78,50.88 5.73,50.83 5.73,50.3 5.45,50.02 5.45,47.99 5.07,47.61 5.07,47.03 5.12,46.98 5.12,45.29 4.81,44.99 4.81,41.03 3.39,39.6 JP9.5
IO13
  Top 0.152: R20.2 9.52,44.67 9.52,47.38 8.55,48.34 U2.16 6.24,48.34 5.42,47.53 5.42,45.16 5.12,44.86 5.12,40.9 4.56,40.35 4.56,35.67 3.39,34.49 JP9.3
IO14
  Top 0.152: U2.13 5.65,52.15 5.42,51.92 5.42,50.42 5.15,50.15 5.15,48.12 4.77,47.73 4.77,46.9 4.81,46.85 4.81,45.42 4.51,45.11 4.51,43.26 3.39,42.14 JP9.6
IO15
  Top 0.152: U2.23 26.05,48.34 26.54,47.85 26.54,44.91 27.04,44.41 27.04,42.17 27.48,41.74 27.48,41.09 27.46,41.07 27.46,37.64 28.88,36.22 JP8.14
IO18
  Top 0.152: U2.30 25.87,57.23 27.46,55.65 27.46,52.6 27.83,52.22 27.83,51.18 27.76,51.11 27.76,50.09 28.97,48.88 28.97,48.2 JP8.9
IO19
  Top 0.152: U2.31 25.36,58.5 27.76,56.11 27.76,52.72 28.82,51.66 28.82,50.7 JP8.8
IO21
  Top 0.152: U2.33 26.48,61.04 27.76,59.76 27.76,57.8 28.88,56.68 JP8.6
  Bottom 0.152: R16.1 26.18,55.58 | 26.18,55.58 28.74,55.58 JP8.6 | 1R12.2 23.21,37.36 23.21,38.83 23.64,39.27 24.77,39.27 24.9,39.4 24.9,40.29 24.55,40.64 24.55,53.96 26.18,55.58
IO22  (via drill 0.35)
  Top 0.152: JP8.3 27.37,64.85 U2.36 22.8,64.85 21.58,63.63 v21.58,62.03
  Bottom 0.152: R14.1 JP8.3 | 1R11.2 22.01,39.2 23.87,41.05 23.87,59.75 v21.58,62.03
IO23  (via drill 0.35)
  Top 0.152: U2.37 24.71,66.12 | 24.71,66.12 28.64,66.12 JP8.2 | v20.77,66.02 24.6,66.02 24.71,66.12
  Bottom 0.152: 18.78,34.54 1R9.2 18.79,34.26 18.79,34.61 17.75,35.65 15.54,35.65 14.63,36.56 14.63,37.44 13.94,38.13 13.94,49.56 15.86,51.49 15.86,61.16 20.74,66.05 v20.77,66.02
IO25
  Top 0.152: U2.10 5.37,55.96 4.81,55.4 4.81,53.3 4.51,52.99 4.51,50.8 3.39,49.68 JP9.9
IO26  (via drill 0.35)
  Top 0.152: U2.11 5.55,54.69 5.12,54.26 5.12,53.17 4.81,52.86 4.81,50.67 4.54,50.4 4.54,48.37 3.39,47.22 JP9.8 | R21.2 6.44,29.33 7.59,30.48 8.54,30.48 8.67,30.62 8.67,31.5 8.54,31.64 7.88,31.64 6.69,32.83 6.69,35 6.09,35.61 6.09,39.72 8.12,41.75 10.25,41.75 10.62,42.11 10.62,45.87 v10.58,45.9
  Bottom 0.152: v10.58,45.9 3.75,45.9 JP9.8
IO27  (via drill 0.35)
  Top 0.152: U2.12 5.8,53.42 5.12,52.74 5.12,50.55 4.84,50.27 4.84,48.24 4.33,47.73 4.33,46.9 4.51,46.73 4.51,45.8 3.39,44.68 JP9.7 | R22.2 6.39,32.67 6.39,34.88 5.78,35.48 5.78,39.84 6.34,40.4 6.34,41.2 v6.64,41.5
  Bottom 0.152: v6.64,41.5 5.61,41.5 JP9.7
IO32
  Top 0.152: JP9.11 3.39,54.84 4.51,55.96 4.51,57.99 5.02,58.5 U2.8
IO33
  Top 0.152: JP9.10 3.39,52.3 4.51,53.42 4.51,55.53 4.81,55.84 4.81,56.7 5.35,57.23 U2.9
IO34
  Top 0.152: JP9.13 3.39,59.92 4.67,61.2 7.36,61.2 U2.6
IO35  (via drill 0.35)
  Top 0.152: JP9.12 3.39,56.67 | 3.39,56.67 3.39,57.38 4.51,58.5 4.51,59.23 5.05,59.77 U2.7 | v2.65,29.75 2.12,30.28 2.12,55.4 3.39,56.67
  Bottom 0.152: 1R16.2 24.78,20.67 1R17.1 23.52,20.65 23.32,20.45 22.23,20.45 22.1,20.58 22.1,22.95 21.86,23.19 14.99,23.19 13.36,21.55 11.29,21.55 10.39,22.45 10.39,23.51 8.53,25.38 8.53,26.87 8.27,27.13 7.62,27.13 5,29.75 v2.65,29.75
MIC_2N
  Top 0.152: D11.2 22.99,3.36 C30.1 22,4.09 21.39,4.69 21.39,5.76 C14.1 20.67,7.84 20.67,8.74 | 20.67,8.74 U3.10 | JP11.2 27.92,24.46 C13.2 26.56,24.43 C12.2 25.56,23.92 29.3,23.92 29.93,23.3 29.93,22.41 29.3,21.79 28.42,21.79 28.38,21.83 22.65,21.83 21.49,20.67 21.49,18.19 21.31,18.01 20.05,18.01 19.85,17.81 19.85,15.05 19.89,15.01 19.89,9.52 20.67,8.74
MIC_2P  (via drill 0.35)
  Top 0.152: U3.9 19.17,6.41 C10.2 | C11.2 20.55,6.33 C10.2 | C10.2 19.09,6.23 18.39,5.53 18.39,2.82 D10.1 | 17.91,2.34 D10.1 | C12.1 26.56,23.13 C13.1 28.56,23.16 JP11.1 | v28.44,20.48 26.23,18.27 v26.23,18.24 | 24.73,8.59 v24.53,8.39 25.11,8.98 26.28,8.98 26.64,8.62 30.37,8.62 30.52,8.46 30.52,2.09 29.79,1.35 28.95,1.35 27.96,2.34 27.37,2.34 26.59,1.56 18.2,1.56 17.73,2.03 D10.1
  Bottom 0.152: JP11.1 28.44,22.43 v28.44,20.48 | v26.23,18.24 26.54,17.94 26.54,14.54 25.04,13.04 25.04,12.5 25.32,12.22 25.32,9.18 v24.53,8.39
MT-C
  Top 0.152: R18.1 14.35,26.52 14.35,26.51 13.57,25.73 U3.26
N$2
  Top 0.152: U1.8 23.84,35.78 D1.C
N$3
  Top 0.152: R3.2 18.4,36.71 U1.21
N$4
  Top 0.152: R4.2 19.37,37.21 U1.20
N$5
  Bottom 0.152: IC3.1 13.09,33.2 1R7.2 14.42,33.14 1R8.1 14.92,33.37 15.55,34 17.23,34 1R9.1
N$6
  Bottom 0.152: R5.2 18.82,42.85 IC2.2
N$7
  Top 0.152: R12.2 R13.1 17.09,7.37 17.09,9.15 17.77,9.83 U3.50
N$8
  Bottom 0.152: IC1.1 10.82,56.26 1R1.2 8.17,56.26 1R2.1
N$9
  Bottom 0.152: L1.2 13.03,57.04 IC1.3
N$10
  Bottom 0.152: IC3.3 9.92,32.83 9.92,28.76 9.98,28.82 | 9.98,28.82 | 9.98,28.82 10.03,28.77 10.03,29.41 L2.2
N$11
  Bottom 0.152: 1R3.1 11.59,51.72 1C2.2 11.56,52.91 IC1.5 9.93,52.14 1R4.2
N$12
  Top 0.152: R11.1 12.42,25.48 12.71,25.48 12.89,25.31 12.89,24.06 13.57,23.38 U3.64
N$13
  Bottom 0.152: 1R5.1 15.82,34.72 15.19,34.09 14.1,34.09 13.97,34.22 13.97,36.41 1R6.2 12.93,37.46 1C8.2 11.02,36.24 IC3.5
N$14
  Top 0.152: R20.1 8.74,42.6 LED2.A
N$15
  Top 0.152: R18.2 16.29,27.16 R17.2 16.75,28.22 Q2.1
N$17
  Bottom 0.152: 1R15.2 21.33,19.73 1C14.1
N$19
  Top 0.152: Q1.2 12.79,33.86 PAD1.1
N$20
  Bottom 0.152: 1C11.2 19.2,37.01 1R10.2
N$21
  Bottom 0.152: 1R11.1 22.19,35.63 IC4.2
N$22
  Top 0.152: U3.31 6.47,25.2 6.75,25.48 6.75,25.72 R10.1 R9.2
N$23
  Top 0.152: R8.2 15.69,7.53 15.69,9.15 16.37,9.83 U3.49
N$24
  Bottom 0.152: 1R19.1 26.92,27.4 1C15.2 25.75,28.56 IC4.5
N$25
  Bottom 0.152: 1R12.1 23.51,34.04 IC4.3
N$26
  Bottom 0.152: 24.87,23.41 1R16.1 24.78,24.71 D14.A 26.97,22.52 26.97,12.27 26.57,11.87 CN1.2
N$27
  Bottom 0.152: 1R13.1 25.01,34.27 IC4.4
N$29
  Top 0.152: Q1.1 16.92,30.5 Q2.3 17.97,31.28 19.37,29.88 19.37,29.61 R19.1 C8.2
N$31
  Top 0.152: R11.2 12.2,27.01 LED1.A
N$32
  Bottom 0.152: J4.2 22.19,26.18 IC4.7
N$36  (via drill 0.35)
  Top 0.152: 1R20.2 10.17,1.72 S1.3 S1.1 12.67,2.45 16.45,2.45 17.65,1.25 27.25,1.25 v27.63,1.63
  Bottom 0.152: 26.23,3.03 v27.63,1.63 28.85,1.63 29.15,1.33 29.73,1.33 30.11,1.71 30.11,2.19 27.97,4.33 27.97,7.87 27.27,8.57 27.27,9.91 28.49,11.13 28.49,12.53 27.27,13.75 27.27,22.68 26.92,23.03 1R19.2
PWRKEY
  Top 0.152: R7.2 12.89,7.86 12.89,9.15 13.03,9.28 14.1,9.28 U3.48
RST/EN  (via drill 0.35)
  Top 0.152: 1R20.1 8.51,3.27 7.97,2.73 3.16,2.73 v1.64,4.25 | JP9.16 4.66,66.58 6.39,64.85 U2.3 14.75,64.85 v14.8,64.8 | U$10.6 20.75,42.25 v20.36,41.87
  Bottom 0.152: v1.64,4.25 1.64,64.83 JP9.16 3.67,66.87 5.26,66.87 1R18.1 5.58,66.87 5.58,65.6 1C16.1 | v14.8,64.8 16.58,66.59 16.58,67.92 16.72,68.06 19.59,68.06 21.38,66.27 21.38,65.77 20.36,64.76 v20.36,41.87
RTS
  Top 0.152: U$10.5 21.96,41.42 21.53,40.99 21.53,40.63 U$10.1 19.86,38.95 U1.19
S_VN/39  (via drill 0.35)
  Top 0.152: JP9.14 4.2,62.31 U2.5 7.53,62.34 9.03,62.34 12.28,59.09 12.28,57.3 15,54.58 15,52.26 14.65,51.91 14.55,51.91 12.54,49.89 12.54,41.66 v14.9,39.3
  Bottom 0.152: 1R14.1 25.01,37.76 1R13.2 24.66,37.08 24.06,36.48 21.52,36.48 21.47,36.53 20.15,36.53 19.78,36.89 19.78,37.84 19.65,37.97 16.23,37.97 v14.9,39.3
S_VP
  Top 0.152: U2.4 7.05,64.04 JP9.15
SD0
  Top 0.152: U2.21 24.69,45.62 25.7,45.62 25.93,45.39 25.93,44.66 26.43,44.16 26.43,41.92 26.85,41.5 26.85,32.36 JP8.16
SD1
  Top 0.152: U2.22 25.93,47.07 26.24,46.77 26.24,44.78 26.74,44.28 26.74,42.04 27.17,41.61 27.17,41.22 27.15,41.2 27.15,35.53 29.07,33.61 29.07,33.06 JP8.15
SD2
  Top 0.152: JP9.2 4.56,32.2 4.56,35.24 4.87,35.54 4.87,40.22 5.42,40.77 5.42,44.73 5.73,45.04 5.73,46.67 6.13,47.07 U2.17
SD3
  Top 0.152: U2.18 6.16,45.8 6.03,45.68 6.03,44.91 5.73,44.61 5.73,40.65 5.17,40.09 5.17,35.42 4.87,35.11 4.87,30.84 3.39,29.36 JP9.1
SIM_ANT
  Top 0.152: U3.40 4.19,11.7 J3.3 4.01,9.48 ANT1.1
SIM_CLK  (via drill 0.35)
  Top 0.152: U3.55 18.87,15.9 v18.48,16.3
  Bottom 0.152: J2.C3 16.26,16.13 D8.2 17.56,17.21 v18.48,16.3
SIM_IO  (via drill 0.35)
  Top 0.152: v21.75,15.87 21.75,15.42 21.45,15.12 21.14,15.12 20.82,14.8 U3.14
  Bottom 0.152: D7.2 15.05,17.16 C6.1 14.95,15.8 J2.C7 15.11,15.75 15.11,14.8 20.63,14.8 21.73,15.9 v21.75,15.87
SIM_RST  (via drill 0.35)
  Top 0.152: v21.77,16.8 20.88,15.9 U3.15
  Bottom 0.152: J2.C2 13.66,15.82 D9.2 13.84,17.34 13.84,17.98 17.64,17.98 18.67,16.95 21.62,16.95 v21.77,16.8
SPK_2N  (via drill 0.35)
  Top 0.152: v20.5,10.24 20.56,10.3 U3.11
  Bottom 0.152: C28.1 5.18,18.08 JP1.1 | C28.1 C29.1 7.21,18.59 D13.2 8.73,18.26 9.27,17.72 9.27,15.13 14.99,9.4 19.66,9.4 v20.5,10.24 | C28.1 5.66,20.03 5.66,20.04 | 5.66,20.04 C26.2 | C20.2 7.09,20.04 5.66,20.04
SPK_2P  (via drill 0.35)
  Top 0.152: v19.19,10.01 19.17,10.04 U3.51
  Bottom 0.152: JP1.2 4.09,21.36 C26.1 | C26.1 5.73,21.41 C20.1 8.08,21.41 8.34,21.14 9.56,21.14 D12.1 | D12.1 10.09,22.69 C18.2 | C26.1 5.72,21.39 C16.2 | D12.1 10.09,16.8 10.57,16.33 10.57,14.26 14.82,10.01 v19.19,10.01
U0RXD
  Top 0.152: JP8.5 28.92,58.31 28.92,59.16 25.77,62.31 U2.34 22.7,62.31 22.35,61.96 22.35,61.43 16.32,55.4 16.32,39.09 16.24,39.01 16.24,37.57 R3.1
U0TXD  (via drill 0.35)
  Top 0.152: JP8.4 29.02,60.95 29.02,61.4 26.84,63.58 U2.35 24.48,63.56 v22.88,63.56 | 17.1,38.74 R4.1 16.64,38.64 16.64,55.21 22.95,61.53 v22.95,61.71
  Bottom 0.152: v22.95,61.71 22.95,63.48 v22.88,63.56
VBAT
  Bottom 0.152: D14.C 23.04,24.77 J4.1 | IC4.6 22.99,28.09 J4.1 | J4.1 22.71,24.5 1C13.1 22.71,21.09 1R15.1
VBUS  (via drill 0.35)
  Top 0.203: D3.A 22.52,19.68 22.52,15.65 22.66,15.51 | 22.66,15.51 22.86,15.31 J1.A9 24.18,15.31 24.34,15.16 24.69,15.16 J1.B4 | J1.B9 24.69,12.47 24.34,12.47 24.18,12.31 J1.A4 23.13,12.31 22.89,12.07 22.89,11.85 v22.61,11.58 | 22.66,15.51 22.66,15.03 v22.54,14.91
  Bottom 0.203: v22.54,14.91 23.44,14.01 23.44,12.4 v22.61,11.58
VCC3V3  (via drill 0.35)
  Top 0.203: U2.2 6.39,66.12 JP9.17 | Q1.3 12.05,30.72 14.71,28.06 15.08,28.43 | 15.08,28.43 15.66,27.84 15.66,26.58 15.81,26.43 19.54,26.43 20.2,27.09 R19.2 C8.1 22.84,27.94 22.84,29.04 C24.1 | v20.52,67.99 16.98,67.99 v15.5,66.51 | v15.42,28.77 15.08,28.43 | v17.2,33.26 17.1,33.36 17.1,35.03 v11.93,40.2
  Bottom 0.203: JP9.17 4.32,68.2 1R18.2 5.88,68.2 1C3.1 12.49,67.13 EL1.+ | EL1.+ 13.14,66.48 1C4.1 C7.1 13.14,61.85 L1.1 12.34,60.84 15.53,57.65 15.53,52.18 14.81,51.47 13.14,51.47 1C2.1 12.88,51.72 12.88,50.37 | 1R3.2 12.88,50.37 | 12.88,50.37 11.66,49.15 1C10.1 11.93,48.77 v11.93,40.2 | 1R14.2 24.22,54.99 R16.2 24.92,55.68 R14.2 20.52,67.76 v20.52,67.99 | v15.5,66.51 13.1,66.51 EL1.+ | v15.42,28.77 16.29,28.77 17.01,29.5 17.01,32.79 17.2,32.98 v17.2,33.26
VCC_UART  (via drill 0.35)
  Top 0.203: C2.1 23.03,33.07 C4.1 22.56,33.54 U1.5 U1.6 U1.7 24,35.12 25.9,35.12 v25.9,37.98 | v22.57,44.53 19.6,47.5 v19.55,47.5 | v19.55,63.7 19.55,66.87 v22.73,66.87
  Bottom 0.203: IC2.5 22.41,41.78 | 22.41,41.78 23.18,41.78 C1.1 | 22.41,41.78 22.41,44.37 v22.57,44.53 | v19.55,47.5 19.87,47.82 19.87,63.38 v19.55,63.7 | v22.73,66.87 25.58,64.01 25.58,59.89 28.44,57.03 30.03,57.03 30.03,39.88 29.39,39.25 25.9,39.25 v25.9,37.98
VSIM  (via drill 0.35)
  Top 0.152: v21.88,17.7 21.43,17.7 21.4,17.68 21.04,17.68 U3.16
  Bottom 0.152: J2.C1 11.18,17.25 C5.1 | C5.1 12.29,17.34 D5.2 | C5.1 10.41,18.03 10.41,19.62 11.07,20.28 18.89,20.28 21.57,17.6 21.77,17.6 v21.88,17.7